# EAGLE design Electronic_Load_AD_V2A (EAGLE 9.1.2)

## Sheet 1 of 6
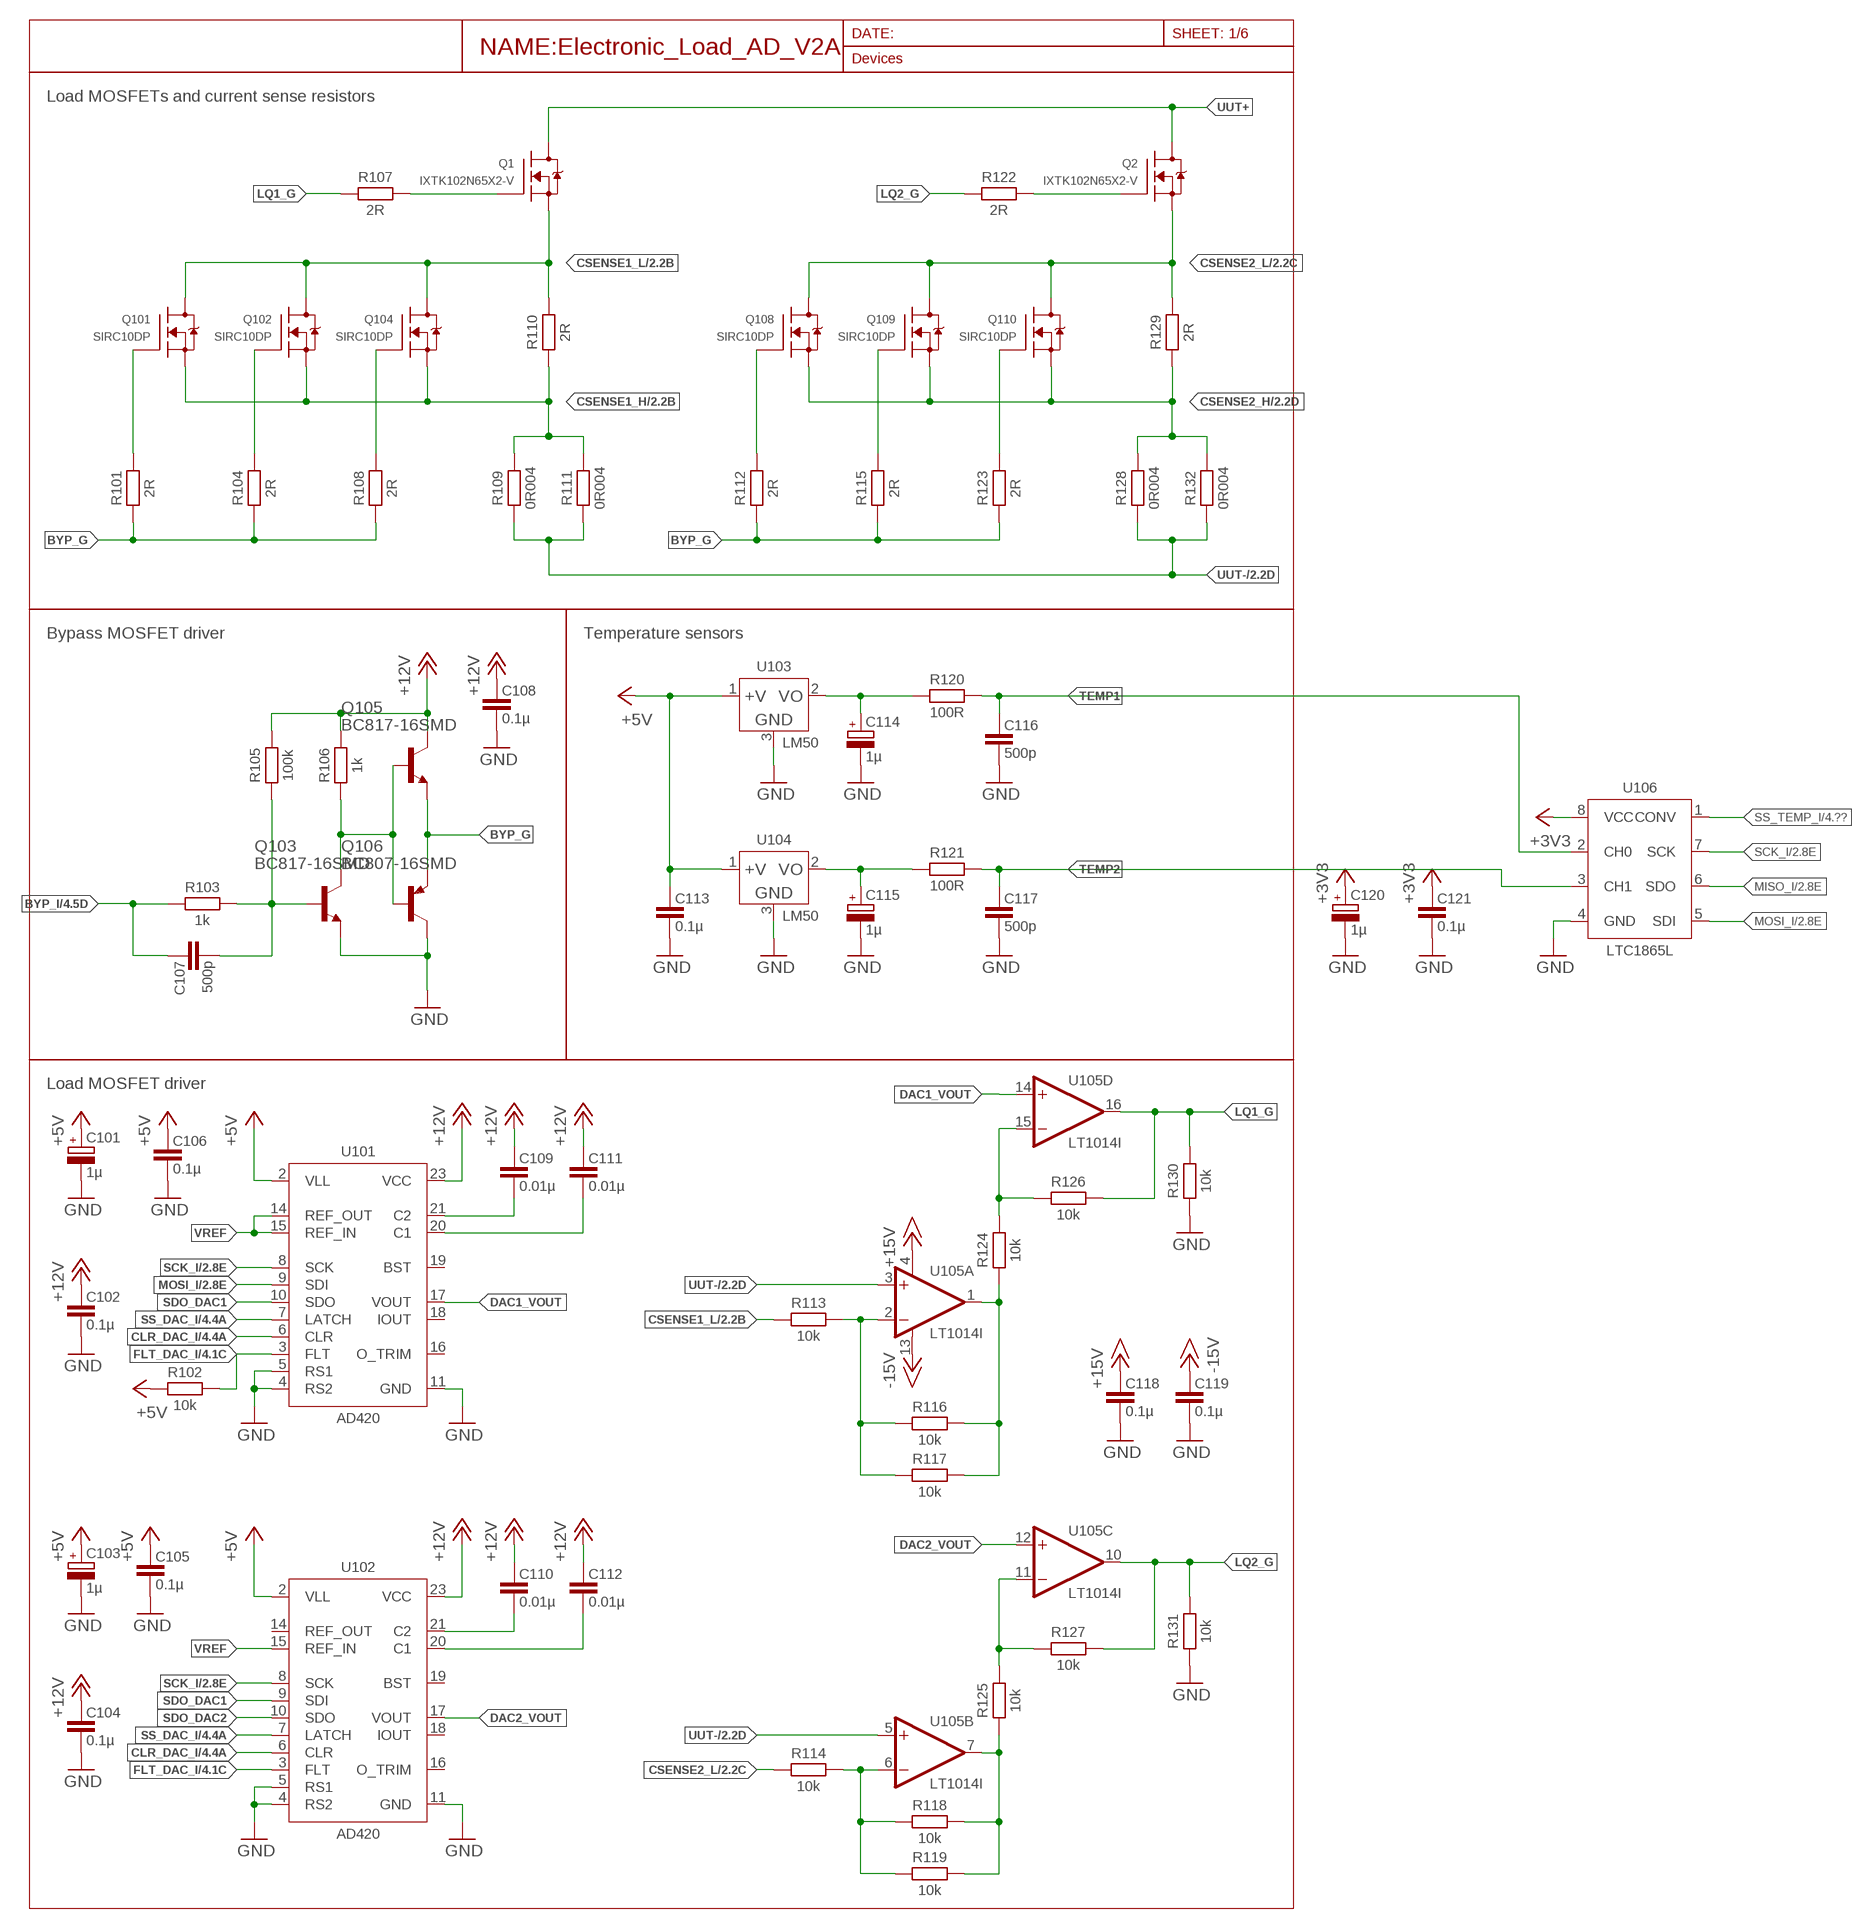
[diagram p0: schematic, sheet 1]

### Parts
C101  1µ  CPOL-3216-A  [CT3216]
C102  0.1µ  C-EU-3216  [C3216]
C103  1µ  CPOL-3216-A  [CT3216]
C104  0.1µ  C-EU-3216  [C3216]
C105  0.1µ  C-EU-3216  [C3216]
C106  0.1µ  C-EU-3216  [C3216]
C107  500p  C-EU-1608  [C1608]
C108  0.1µ  C-EU-3216  [C3216]
C109  0.01µ  C-EU-3216  [C3216]
C110  0.01µ  C-EU-3216  [C3216]
C111  0.01µ  C-EU-3216  [C3216]
C112  0.01µ  C-EU-3216  [C3216]
C113  0.1µ  C-EU-3216  [C3216]
C114  1µ  CPOL-3216-A  [CT3216]
C115  1µ  CPOL-3216-A  [CT3216]
C116  500p  C-EU-1608  [C1608]
C117  500p  C-EU-1608  [C1608]
C118  0.1µ  C-EU-3216  [C3216]
C119  0.1µ  C-EU-3216  [C3216]
C120  1µ  CPOL-3216-A  [CT3216]
C121  0.1µ  C-EU-3216  [C3216]
Q1  IXTK102N65X2-V  [TO-264P-V]
Q2  IXTK102N65X2-V  [TO-264P-V]
Q101  SIRC10DP  [POWERPAK-SO-8]
Q102  SIRC10DP  [POWERPAK-SO-8]
Q103  BC817-16SMD  [SOT23-BEC]
Q104  SIRC10DP  [POWERPAK-SO-8]
Q105  BC817-16SMD  [SOT23-BEC]
Q106  BC807-16SMD  [SOT23-BEC]
Q108  SIRC10DP  [POWERPAK-SO-8]
Q109  SIRC10DP  [POWERPAK-SO-8]
Q110  SIRC10DP  [POWERPAK-SO-8]
R101  2R  R-EU-2012  [R2012W]
R102  10k  R-EU-1608  [R1608]
R103  1k  R-EU-1608  [R1608]
R104  2R  R-EU-2012  [R2012W]
R105  100k  R-EU-1608  [R1608]
R106  1k  R-EU-1608  [R1608]
R107  2R  R-EU-2012  [R2012W]
R108  2R  R-EU-2012  [R2012W]
R109  0R004  R-EU-6332  [R6332W]
R110  2R  R-EU-3216  [R3216W]
R111  0R004  R-EU-6332  [R6332W]
R112  2R  R-EU-2012  [R2012W]
R113  10k  R-EU-1608  [R1608]
R114  10k  R-EU-1608  [R1608]
R115  2R  R-EU-2012  [R2012W]
R116  10k  R-EU-1608  [R1608]
R117  10k  R-EU-1608  [R1608]
R118  10k  R-EU-1608  [R1608]
R119  10k  R-EU-1608  [R1608]
R120  100R  R-EU-2012  [R2012W]
R121  100R  R-EU-2012  [R2012W]
R122  2R  R-EU-2012  [R2012W]
R123  2R  R-EU-2012  [R2012W]
R124  10k  R-EU-1608  [R1608]
R125  10k  R-EU-1608  [R1608]
R126  10k  R-EU-1608  [R1608]
R127  10k  R-EU-1608  [R1608]
R128  0R004  R-EU-6332  [R6332W]
R129  2R  R-EU-3216  [R3216W]
R130  10k  R-EU-1608  [R1608]
R131  10k  R-EU-1608  [R1608]
R132  0R004  R-EU-6332  [R6332W]
U101  AD420  AD420RW-24  [SO24W]
U102  AD420  AD420RW-24  [SO24W]
U103  LM50  [SOT23W]
U104  LM50  [SOT23W]
U105  LT1014I  LT1014ISW  [SO16W]
U106  LTC1865L  [SO8]

### Nets
+3V3: C120.+ C121.1 U106.8(VCC) ; also sheet 2,3
+5V: C101.+ C103.+ C105.1 C106.1 C113.1 R102.1 U101.2(VLL) U102.2(VLL) U103.1(+V) U104.1(+V) ; also sheet 3,4
+12V: C102.1 C104.1 C108.1 C109.1 C110.1 C111.1 C112.1 Q105.C R105.2 R106.2 U101.23(VCC) U102.23(VCC) ; also sheet 3
+15V: C118.1 U105.4(A:V+) ; also sheet 2,3
-15V: C119.1 U105.13(A:V-) ; also sheet 2,3
BYP_G: Q105.E Q106.E R101.1 R104.1 R108.1 R112.1 R115.1 R123.1
BYP_I: C107.1 R103.1 ; also sheet 4
CLR_DAC_I: U101.6(CLR) U102.6(CLR) ; also sheet 4
CSENSE1_H: Q101.1(S) Q101.2(S) Q101.3(S) Q102.1(S) Q102.2(S) Q102.3(S) Q104.1(S) Q104.2(S) Q104.3(S) R109.2 R110.1 R111.2 ; also sheet 2
CSENSE1_L: Q1.3(S) Q101.5(D) Q102.5(D) Q104.5(D) R110.2 R113.1 ; also sheet 2,6
CSENSE2_H: Q108.1(S) Q108.2(S) Q108.3(S) Q109.1(S) Q109.2(S) Q109.3(S) Q110.1(S) Q110.2(S) Q110.3(S) R128.2 R129.1 R132.2 ; also sheet 2
CSENSE2_L: Q2.3(S) Q108.5(D) Q109.5(D) Q110.5(D) R114.1 R129.2 ; also sheet 2,6
DAC1_VOUT: U101.17(VOUT) U105.14(D:+IN)
DAC2_VOUT: U102.17(VOUT) U105.12(C:+IN)
FLT_DAC_I: R102.2 U101.3(FLT) U102.3(FLT) ; also sheet 4
GATE1: Q1.1(G) R107.2 ; also sheet 6
GATE2: Q2.1(G) R122.2 ; also sheet 6
GND: C101.- C102.2 C103.- C104.2 C105.2 C106.2 C108.2 C113.2 C114.- C115.- C116.2 C117.2 C118.2 C119.2 C120.- C121.2 Q103.E Q106.C R130.1 R131.1 U101.4(RS2) U101.5(RS1) U101.11(GND) U102.4(RS2) U102.5(RS1) U102.11(GND) U103.3(GND) U104.3(GND) U106.4(GND) ; also sheet 2,3,4
LBQ11_G: Q101.4(G) R101.2
LBQ12_G: Q102.4(G) R104.2
LBQ13_G: Q104.4(G) R108.2
LBQ21_G: Q108.4(G) R112.2
LBQ22_G: Q109.4(G) R115.2
LBQ23_G: Q110.4(G) R123.2
LQ1_G: R107.1 R126.2 R130.2 U105.16(D:OUT)
LQ2_G: R122.1 R127.2 R131.2 U105.10(C:OUT)
MISO_I: U106.6(SDO) ; also sheet 2,4
MOSI_I: U101.9(SDI) U106.5(SDI) ; also sheet 2,4
N$3: C109.2 U101.21(C2)
N$4: C111.2 U101.20(C1)
N$5: Q103.C Q105.B Q106.B R106.1
N$6: C110.2 U102.21(C2)
N$7: C112.2 U102.20(C1)
N$8: C107.2 Q103.B R103.2 R105.1
N$9: R125.2 R127.1 U105.11(C:-IN)
N$12: R124.2 R126.1 U105.15(D:-IN)
N$13: R116.2 R117.2 R124.1 U105.1(A:OUT)
N$14: R113.2 R116.1 R117.1 U105.2(A:-IN)
N$15: R114.2 R118.1 R119.1 U105.6(B:-IN)
N$16: R118.2 R119.2 R125.1 U105.7(B:OUT)
SCK_I: U101.8(SCK) U102.8(SCK) U106.7(SCK) ; also sheet 2,4
SDO_DAC1: U101.10(SDO) U102.9(SDI)
SDO_DAC2: U102.10(SDO)
SS_DAC_I: U101.7(LATCH) U102.7(LATCH) ; also sheet 4
SS_TEMP_I: U106.1(CONV) ; also sheet 4
T1_OUT: C114.+ R120.1 U103.2(VO) ; also sheet 6
T2_OUT: C115.+ R121.1 U104.2(VO) ; also sheet 6
TEMP1: C116.1 R120.2 U106.2(CH0)
TEMP2: C117.1 R121.2 U106.3(CH1)
UUT+ [500V]: Q1.2(D) Q2.2(D)
UUT-: R109.1 R111.1 R128.1 R132.1 U105.3(A:+IN) U105.5(B:+IN) ; also sheet 2,6
VREF: U101.14(REF_OUT) U101.15(REF_IN) U102.15(REF_IN)
Unconnected: U101.16(O_TRIM) U101.18(IOUT) U101.19(BST) U102.14(REF_OUT) U102.16(O_TRIM) U102.18(IOUT) U102.19(BST)

### Notes on the sheet
- Load MOSFETs and current sense resistors
- Bypass MOSFET driver | Temperature sensors
- Load MOSFET driver

## Sheet 2 of 6
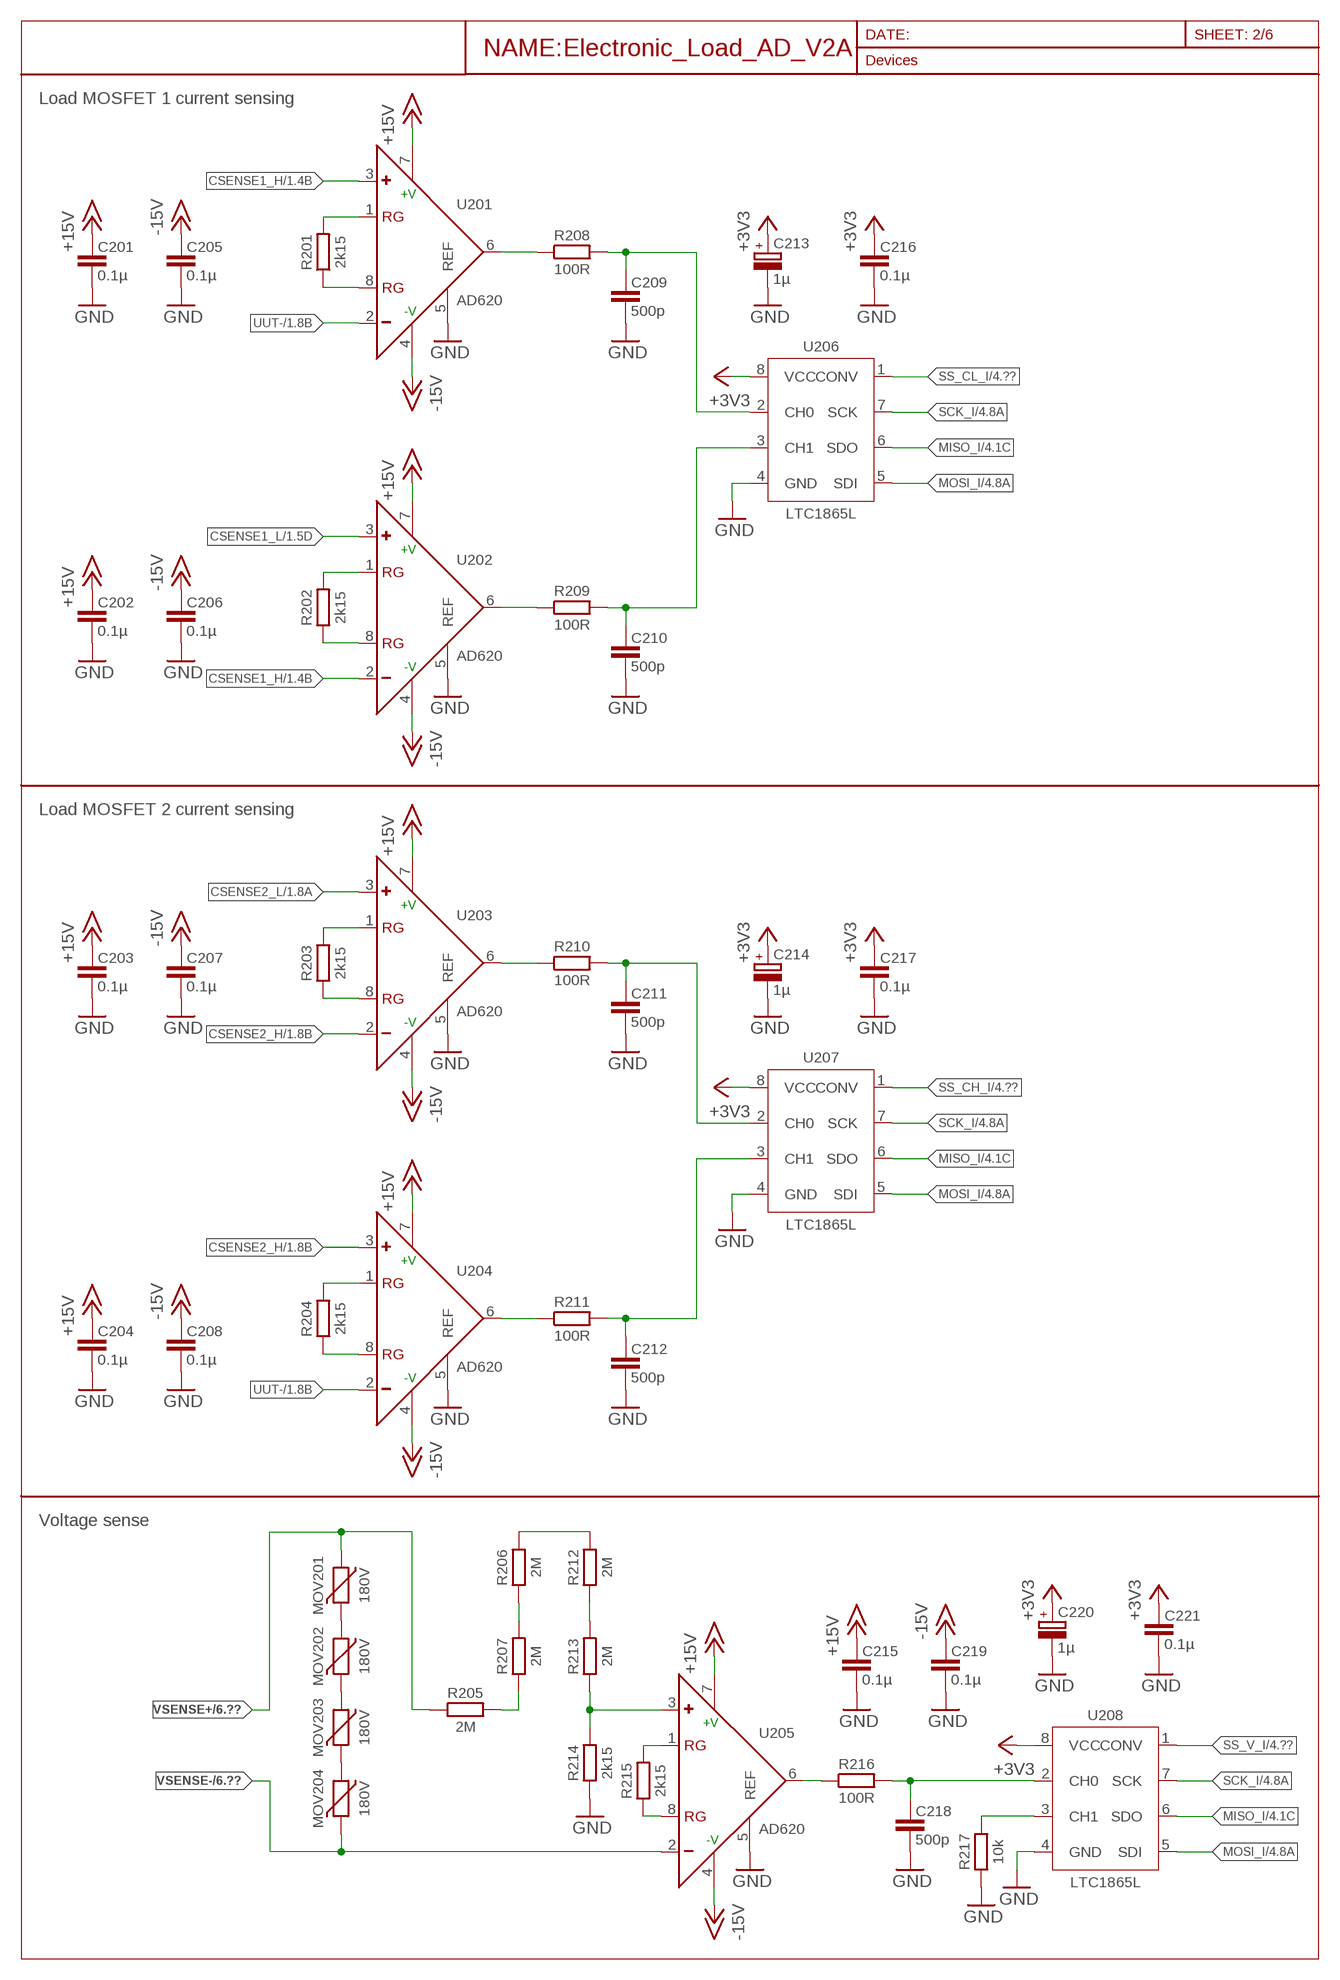
[diagram p1: schematic, sheet 2]

### Parts
C201  0.1µ  C-EU-3216  [C3216]
C202  0.1µ  C-EU-3216  [C3216]
C203  0.1µ  C-EU-3216  [C3216]
C204  0.1µ  C-EU-3216  [C3216]
C205  0.1µ  C-EU-3216  [C3216]
C206  0.1µ  C-EU-3216  [C3216]
C207  0.1µ  C-EU-3216  [C3216]
C208  0.1µ  C-EU-3216  [C3216]
C209  500p  C-EU-1608  [C1608]
C210  500p  C-EU-1608  [C1608]
C211  500p  C-EU-1608  [C1608]
C212  500p  C-EU-1608  [C1608]
C213  1µ  CPOL-3216-A  [CT3216]
C214  1µ  CPOL-3216-A  [CT3216]
C215  0.1µ  C-EU-3216  [C3216]
C216  0.1µ  C-EU-3216  [C3216]
C217  0.1µ  C-EU-3216  [C3216]
C218  500p  C-EU-1608  [C1608]
C219  0.1µ  C-EU-3216  [C3216]
C220  1µ  CPOL-3216-A  [CT3216]
C221  0.1µ  C-EU-3216  [C3216]
MOV201  180V  MOV-3225  [R3225W]
MOV202  180V  MOV-3225  [R3225W]
MOV203  180V  MOV-3225  [R3225W]
MOV204  180V  MOV-3225  [R3225W]
R201  2k15  R-EU-2012  [R2012W]
R202  2k15  R-EU-2012  [R2012W]
R203  2k15  R-EU-2012  [R2012W]
R204  2k15  R-EU-2012  [R2012W]
R205  2M  R-EU-3216  [R3216W]
R206  2M  R-EU-3216  [R3216W]
R207  2M  R-EU-3216  [R3216W]
R208  100R  R-EU-2012  [R2012W]
R209  100R  R-EU-2012  [R2012W]
R210  100R  R-EU-2012  [R2012W]
R211  100R  R-EU-2012  [R2012W]
R212  2M  R-EU-3216  [R3216W]
R213  2M  R-EU-3216  [R3216W]
R214  2k15  R-EU-2012  [R2012W]
R215  2k15  R-EU-2012  [R2012W]
R216  100R  R-EU-2012  [R2012W]
R217  10k  R-EU-1608  [R1608]
U201  AD620  AD620R-8  [SO8]
U202  AD620  AD620R-8  [SO8]
U203  AD620  AD620R-8  [SO8]
U204  AD620  AD620R-8  [SO8]
U205  AD620  AD620R-8  [SO8]
U206  LTC1865L  [SO8]
U207  LTC1865L  [SO8]
U208  LTC1865L  [SO8]

### Nets
+3V3: C213.+ C214.+ C216.1 C217.1 C220.+ C221.1 U206.8(VCC) U207.8(VCC) U208.8(VCC) ; also sheet 1,3
+15V: C201.1 C202.1 C203.1 C204.1 C215.1 U201.7(+V) U202.7(+V) U203.7(+V) U204.7(+V) U205.7(+V) ; also sheet 1,3
-15V: C205.1 C206.1 C207.1 C208.1 C219.1 U201.4(-V) U202.4(-V) U203.4(-V) U204.4(-V) U205.4(-V) ; also sheet 1,3
CSENSE1_H: U201.3(+) U202.2(-) ; also sheet 1
CSENSE1_L: U202.3(+) ; also sheet 1,6
CSENSE2_H: U203.2(-) U204.3(+) ; also sheet 1
CSENSE2_L: U203.3(+) ; also sheet 1,6
GND: C201.2 C202.2 C203.2 C204.2 C205.2 C206.2 C207.2 C208.2 C209.2 C210.2 C211.2 C212.2 C213.- C214.- C215.2 C216.2 C217.2 C218.2 C219.2 C220.- C221.2 R214.1 R217.1 U201.5(REF) U202.5(REF) U203.5(REF) U204.5(REF) U205.5(REF) U206.4(GND) U207.4(GND) U208.4(GND) ; also sheet 1,3,4
MISO_I: U206.6(SDO) U207.6(SDO) U208.6(SDO) ; also sheet 1,4
MOSI_I: U206.5(SDI) U207.5(SDI) U208.5(SDI) ; also sheet 1,4
N$1: MOV201.2 MOV202.1
N$2: MOV202.2 MOV203.1
N$17: R210.1 U203.6(OUT)
N$18: C211.1 R210.2 U207.2(CH0)
N$19: R211.1 U204.6(OUT)
N$20: C212.1 R211.2 U207.3(CH1)
N$21: C209.1 R208.2 U206.2(CH0)
N$22: C210.1 R209.2 U206.3(CH1)
N$23: R209.1 U202.6(OUT)
N$24: R208.1 U201.6(OUT)
N$25: R212.1 R213.2
N$26: R206.2 R212.2
N$27: R206.1 R207.2
N$28: R205.2 R207.1
N$29: R213.1 R214.2 U205.3(+)
N$30: C218.1 R216.2 U208.2(CH0)
N$31: R216.1 U205.6(OUT)
N$36: MOV203.2 MOV204.1
N$45: R217.2 U208.3(CH1)
RG1_H4: R203.2 U203.1(RG)
RG1_H5: R204.2 U204.1(RG)
RG1_H6: R215.2 U205.1(RG)
RG1_L3: R201.2 U201.1(RG)
RG1_L4: R202.2 U202.1(RG)
RG2_H4: R203.1 U203.8(RG)
RG2_H5: R204.1 U204.8(RG)
RG2_H6: R215.1 U205.8(RG)
RG2_L3: R201.1 U201.8(RG)
RG2_L4: R202.1 U202.8(RG)
SCK_I: U206.7(SCK) U207.7(SCK) U208.7(SCK) ; also sheet 1,4
SS_CH_I: U207.1(CONV) ; also sheet 4
SS_CL_I: U206.1(CONV) ; also sheet 4
SS_V_I: U208.1(CONV) ; also sheet 4
UUT-: U201.2(-) U204.2(-) ; also sheet 1,6
VSENSE+: MOV201.1 R205.1 ; also sheet 6
VSENSE-: MOV204.2 U205.2(-) ; also sheet 6

### Notes on the sheet
- Load MOSFET 1 current sensing
- Load MOSFET 2 current sensing
- Voltage sense

## Sheet 3 of 6
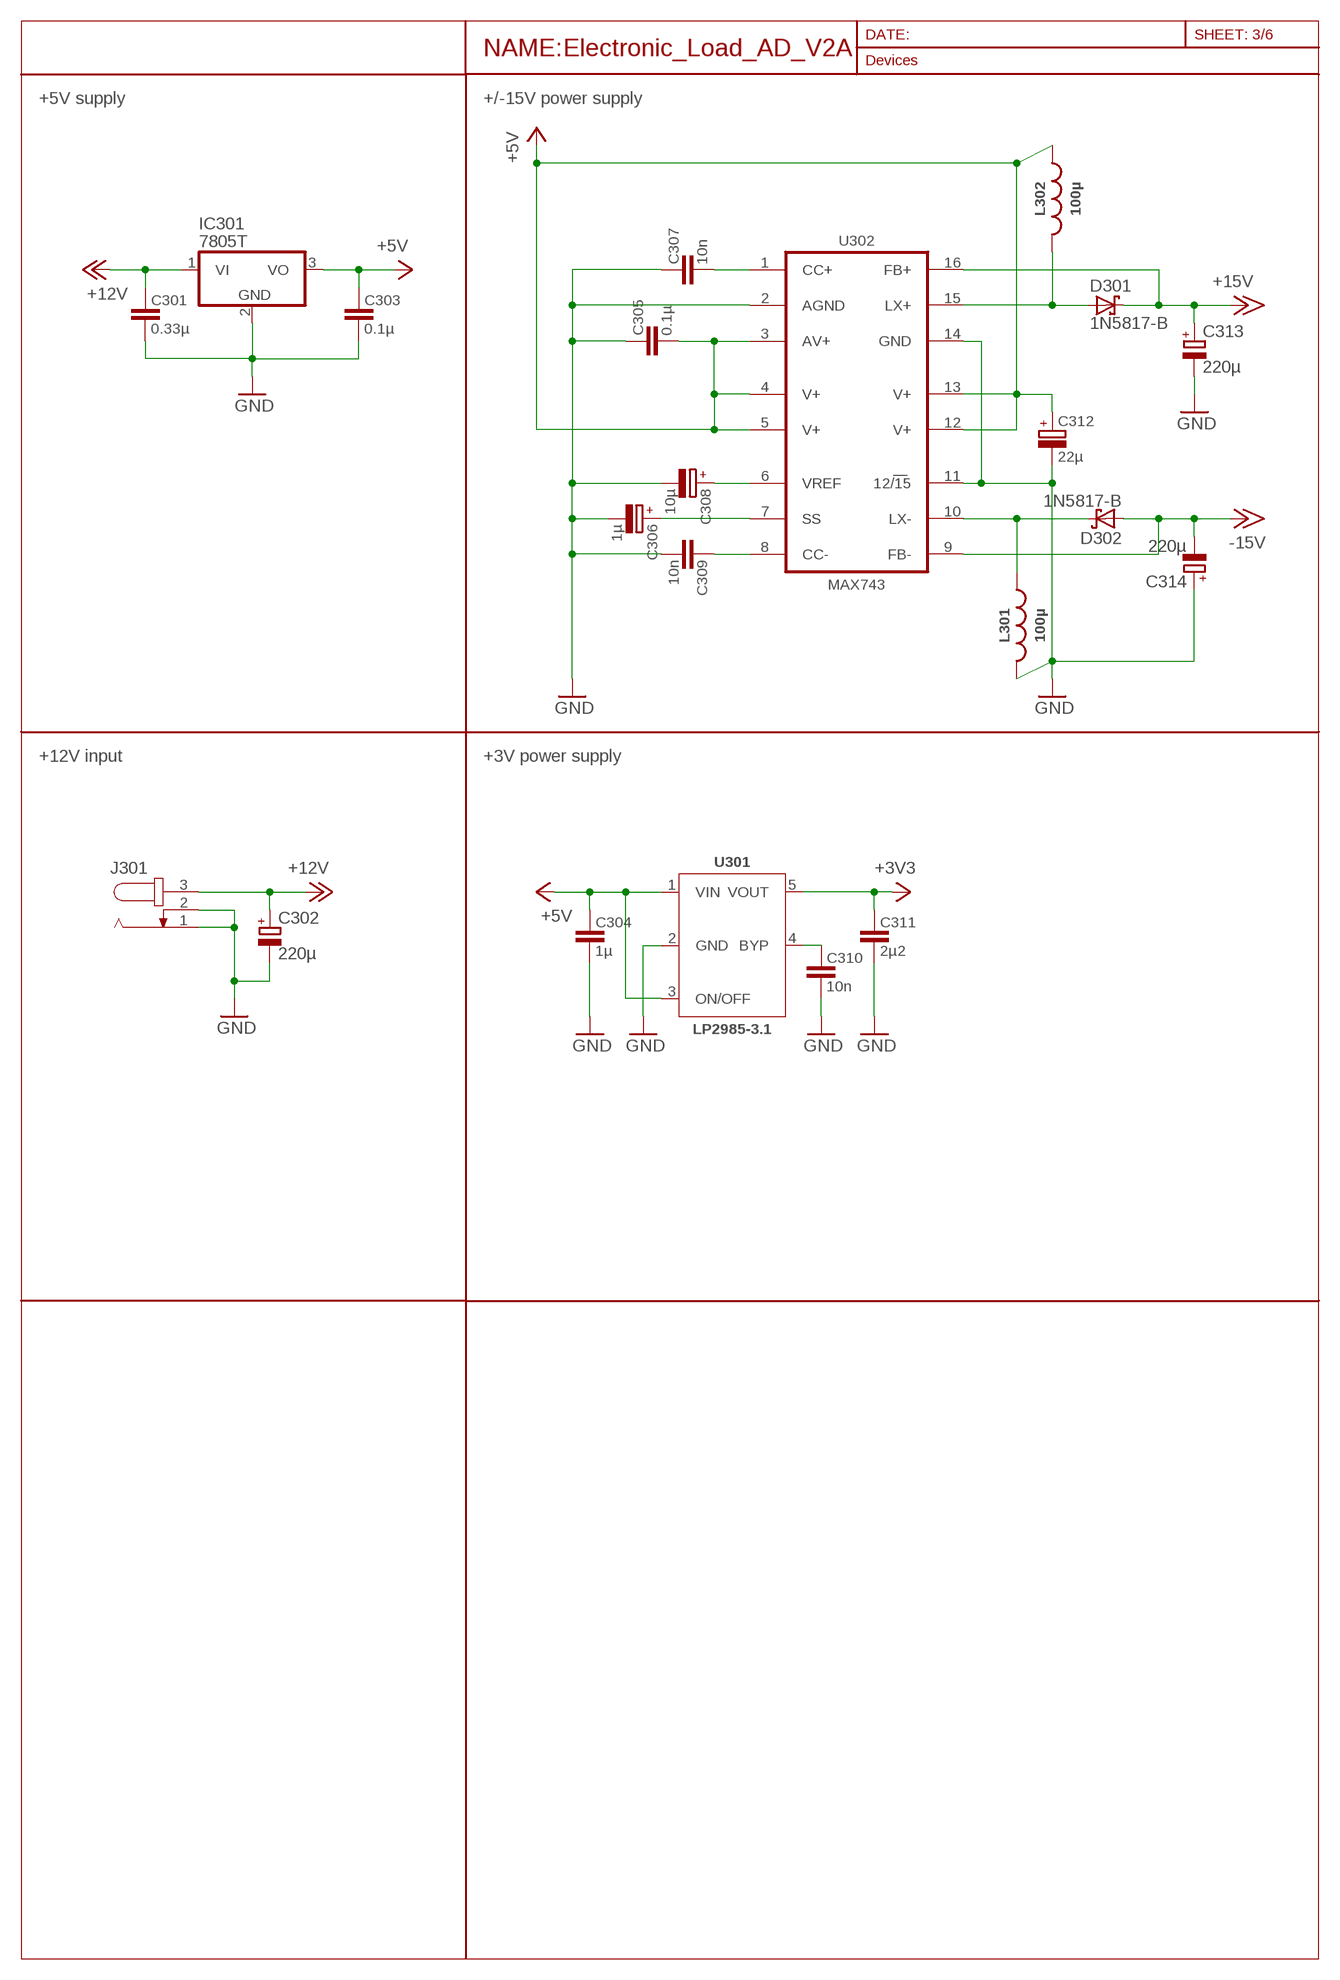
[diagram p2: schematic, sheet 3]

### Parts
C301  0.33µ  C-EU-3216  [C3216]
C302  220µ  CPOL-EUE3.5-10  [E3,5-10]
C303  0.1µ  C-EU-3216  [C3216]
C304  1µ  C-EU-3216  [C3216]
C305  0.1µ  C-EU-3216  [C3216]
C306  1µ  CPOL-3216-A  [CT3216]
C307  10n  C-EU-3216  [C3216]
C308  10µ  CPOL-6032-C  [CT6032]
C309  10n  C-EU-3216  [C3216]
C310  10n  C-EU-3216  [C3216]
C311  2µ2  C-EU-3216  [C3216]
C312  22µ  CPOL-6032-C  [CT6032]
C313  220µ  CPOL-EUE3.5-10  [E3,5-10]
C314  220µ  CPOL-EUE3.5-10  [E3,5-10]
D301  1N5817-B  [DO41-7.6]
D302  1N5817-B  [DO41-7.6]
IC301  7805T  [TO220H]
J301  JACK-PLUG0  [SPC4077]
L301  100µ  L-EUSRN1060  [SRN1060]
L302  100µ  L-EUSRN1060  [SRN1060]
U301  LP2985-3.1  [SOT23-5L]
U302  MAX743  MAX743WE  [SO16W]

### Nets
+3V3: C311.1 U301.5(VOUT) ; also sheet 1,2
+5V: C303.1 C304.1 C305.2 C312.+ IC301.3(VO) L302.1 U301.1(VIN) U301.3(ON/OFF) U302.3(AV+) U302.4(V+) U302.5(V+) U302.12(V+) U302.13(V+) ; also sheet 1,4
+12V: C301.1 C302.+ IC301.1(VI) J301.3 ; also sheet 1
+15V: C313.+ D301.C U302.16(FB+) ; also sheet 1,2
-15V: C314.- D302.A U302.9(FB-) ; also sheet 1,2
GND: C301.2 C302.- C303.2 C304.2 C305.1 C306.- C307.1 C308.- C309.2 C310.2 C311.2 C312.- C313.- C314.+ IC301.2(GND) J301.1 J301.2 L301.2 U301.2(GND) U302.2(AGND) U302.11(12/15) U302.14(GND) ; also sheet 1,2,4
N$10: C310.1 U301.4(BYP)
N$32: C309.1 U302.8(CC-)
N$33: C306.+ U302.7(SS)
N$34: C307.2 U302.1(CC+)
N$35: D301.A L302.2 U302.15(LX+)
N$41: D302.C L301.1 U302.10(LX-)
VREF2: C308.+ U302.6(VREF)

### Notes on the sheet
- +5V supply | +/-15V power supply
- +12V input | +3V power supply

## Sheet 4 of 6
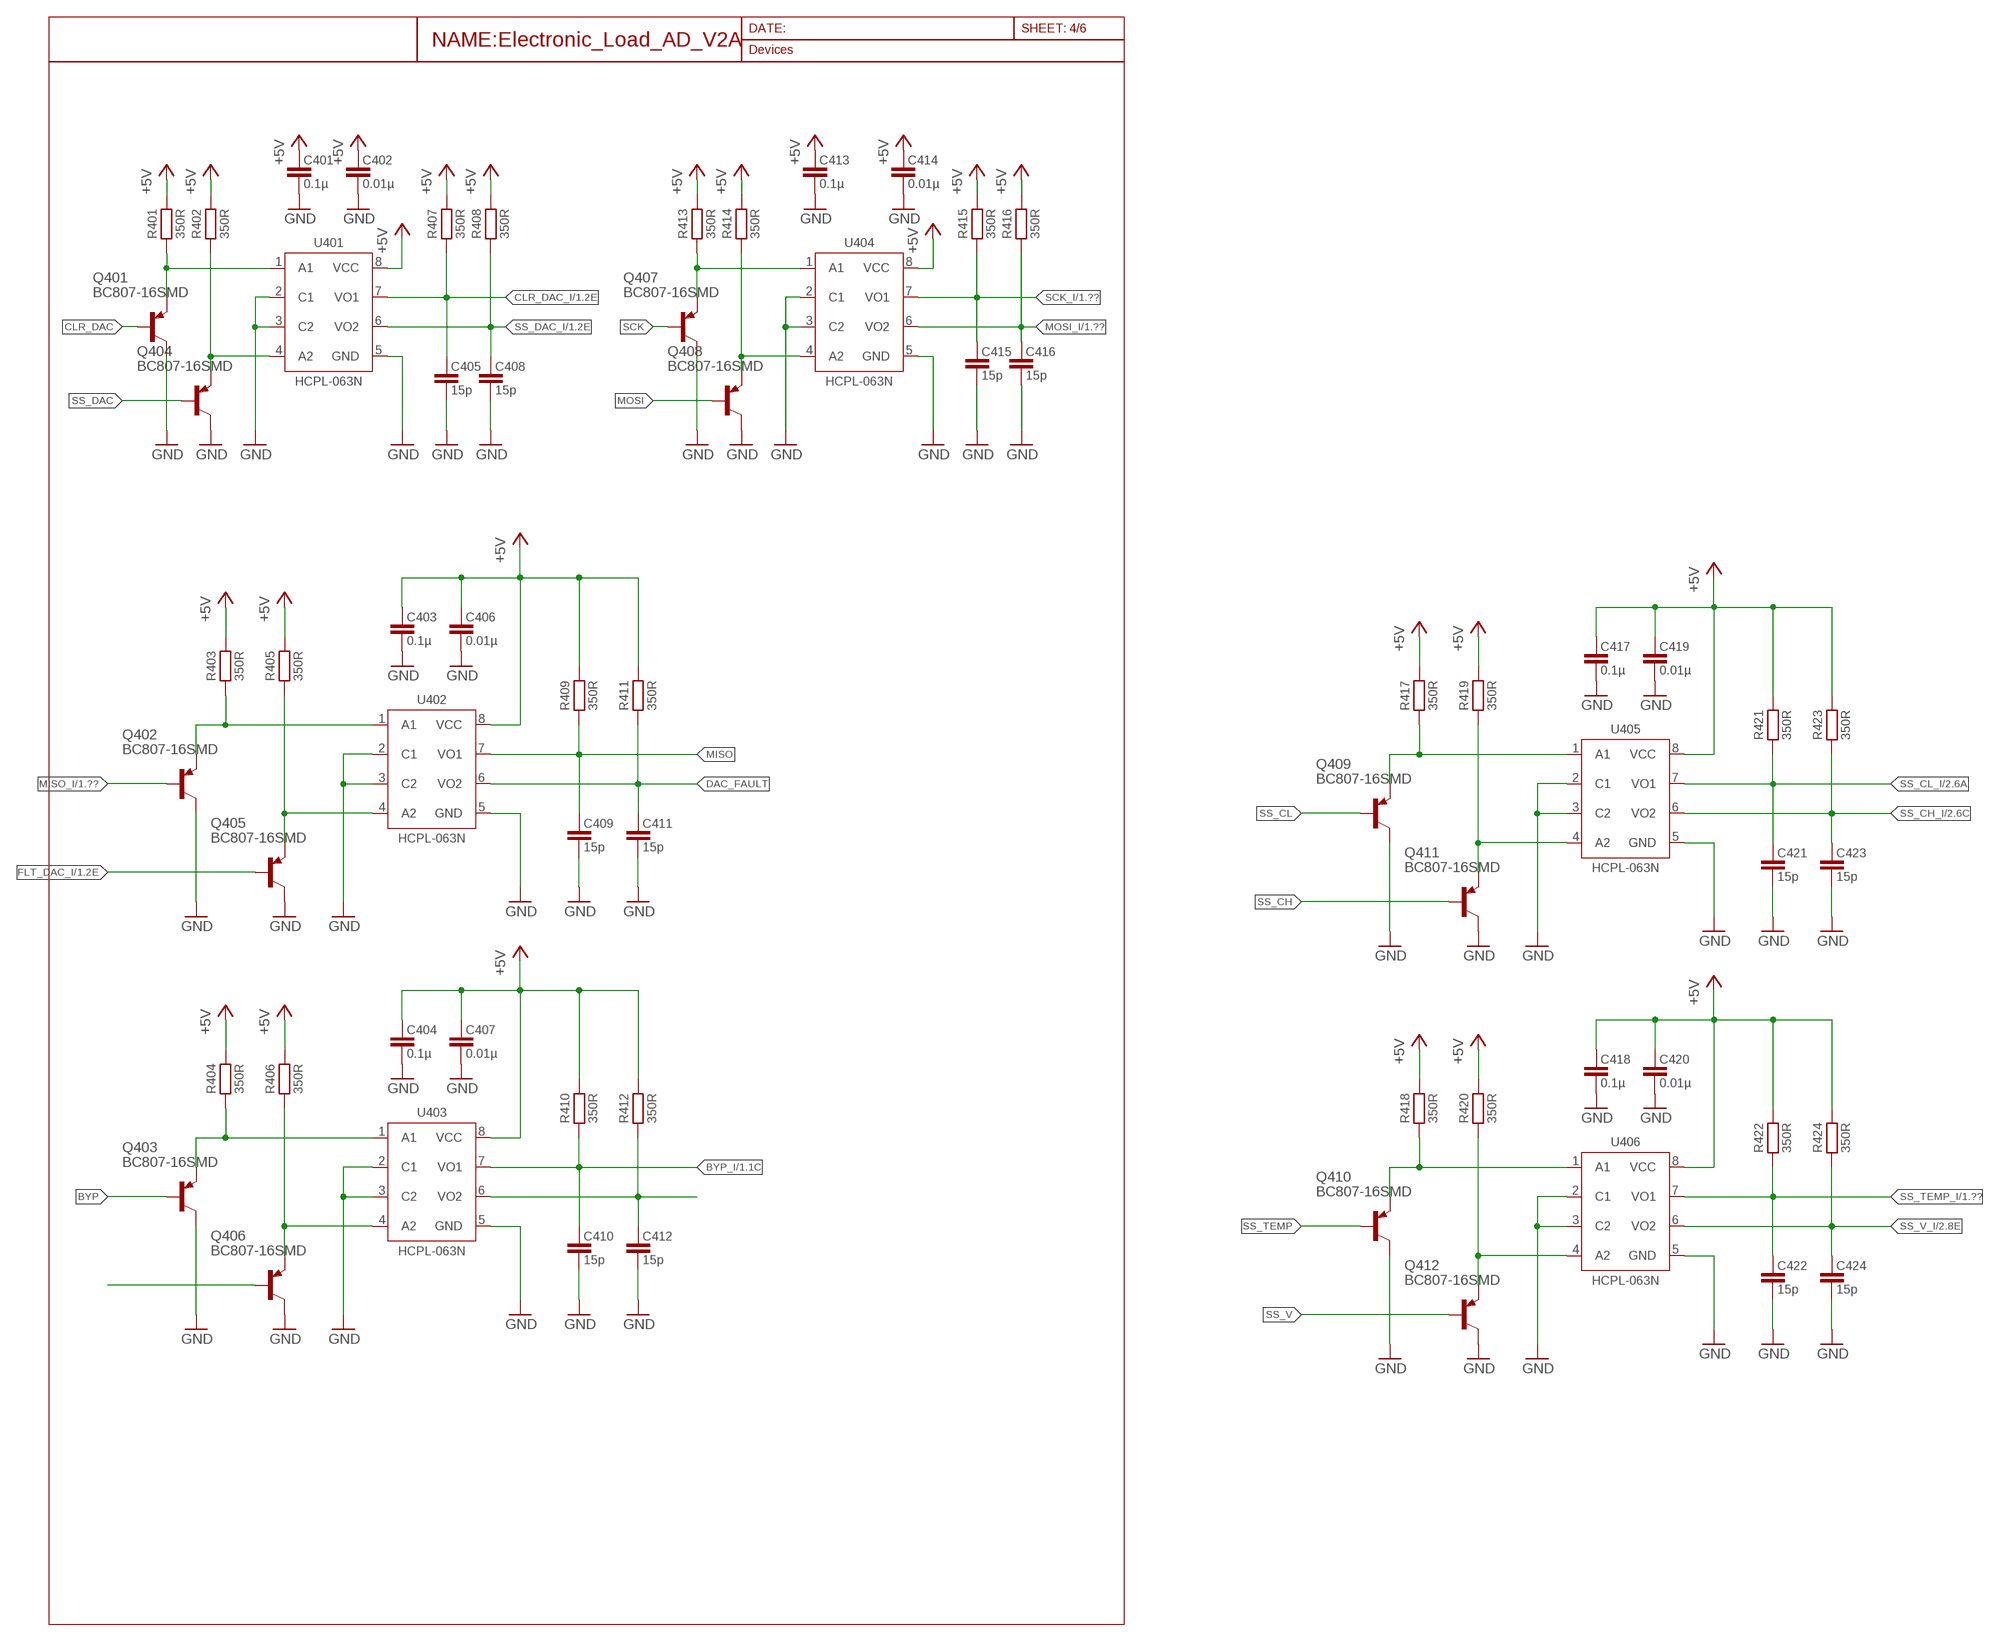
[diagram p3: schematic, sheet 4]

### Parts
C401  0.1µ  C-EU-3216  [C3216]
C402  0.01µ  C-EU-3216  [C3216]
C403  0.1µ  C-EU-3216  [C3216]
C404  0.1µ  C-EU-3216  [C3216]
C405  15p  C-EU-1608  [C1608]
C406  0.01µ  C-EU-3216  [C3216]
C407  0.01µ  C-EU-3216  [C3216]
C408  15p  C-EU-1608  [C1608]
C409  15p  C-EU-1608  [C1608]
C410  15p  C-EU-1608  [C1608]
C411  15p  C-EU-1608  [C1608]
C412  15p  C-EU-1608  [C1608]
C413  0.1µ  C-EU-3216  [C3216]
C414  0.01µ  C-EU-3216  [C3216]
C415  15p  C-EU-1608  [C1608]
C416  15p  C-EU-1608  [C1608]
C417  0.1µ  C-EU-3216  [C3216]
C418  0.1µ  C-EU-3216  [C3216]
C419  0.01µ  C-EU-3216  [C3216]
C420  0.01µ  C-EU-3216  [C3216]
C421  15p  C-EU-1608  [C1608]
C422  15p  C-EU-1608  [C1608]
C423  15p  C-EU-1608  [C1608]
C424  15p  C-EU-1608  [C1608]
Q401  BC807-16SMD  [SOT23-BEC]
Q402  BC807-16SMD  [SOT23-BEC]
Q403  BC807-16SMD  [SOT23-BEC]
Q404  BC807-16SMD  [SOT23-BEC]
Q405  BC807-16SMD  [SOT23-BEC]
Q406  BC807-16SMD  [SOT23-BEC]
Q407  BC807-16SMD  [SOT23-BEC]
Q408  BC807-16SMD  [SOT23-BEC]
Q409  BC807-16SMD  [SOT23-BEC]
Q410  BC807-16SMD  [SOT23-BEC]
Q411  BC807-16SMD  [SOT23-BEC]
Q412  BC807-16SMD  [SOT23-BEC]
R401  350R  R-EU-1608  [R1608]
R402  350R  R-EU-1608  [R1608]
R403  350R  R-EU-1608  [R1608]
R404  350R  R-EU-1608  [R1608]
R405  350R  R-EU-1608  [R1608]
R406  350R  R-EU-1608  [R1608]
R407  350R  R-EU-1608  [R1608]
R408  350R  R-EU-1608  [R1608]
R409  350R  R-EU-1608  [R1608]
R410  350R  R-EU-1608  [R1608]
R411  350R  R-EU-1608  [R1608]
R412  350R  R-EU-1608  [R1608]
R413  350R  R-EU-1608  [R1608]
R414  350R  R-EU-1608  [R1608]
R415  350R  R-EU-1608  [R1608]
R416  350R  R-EU-1608  [R1608]
R417  350R  R-EU-1608  [R1608]
R418  350R  R-EU-1608  [R1608]
R419  350R  R-EU-1608  [R1608]
R420  350R  R-EU-1608  [R1608]
R421  350R  R-EU-1608  [R1608]
R422  350R  R-EU-1608  [R1608]
R423  350R  R-EU-1608  [R1608]
R424  350R  R-EU-1608  [R1608]
U401  HCPL-063N  [SO8]
U402  HCPL-063N  [SO8]
U403  HCPL-063N  [SO8]
U404  HCPL-063N  [SO8]
U405  HCPL-063N  [SO8]
U406  HCPL-063N  [SO8]

### Nets
+5V: C401.1 C402.1 C403.1 C404.1 C406.1 C407.1 C413.1 C414.1 C417.1 C418.1 C419.1 C420.1 R401.2 R402.2 R403.2 R404.2 R405.2 R406.2 R407.2 R408.2 R409.2 R410.2 R411.2 R412.2 R413.2 R414.2 R415.2 R416.2 R417.2 R418.2 R419.2 R420.2 R421.2 R422.2 R423.2 R424.2 U401.8(VCC) U402.8(VCC) U403.8(VCC) U404.8(VCC) U405.8(VCC) U406.8(VCC) ; also sheet 1,3
BYP: Q403.B
BYP_I: C410.1 R410.1 U403.7(VO1) ; also sheet 1
CLR_DAC: Q401.B
CLR_DAC_I: C405.1 R407.1 U401.7(VO1) ; also sheet 1
DAC_FAULT: C411.1 R411.1 U402.6(VO2)
FLT_DAC_I: Q405.B ; also sheet 1
GND: C401.2 C402.2 C403.2 C404.2 C405.2 C406.2 C407.2 C408.2 C409.2 C410.2 C411.2 C412.2 C413.2 C414.2 C415.2 C416.2 C417.2 C418.2 C419.2 C420.2 C421.2 C422.2 C423.2 C424.2 Q401.C Q402.C Q403.C Q404.C Q405.C Q406.C Q407.C Q408.C Q409.C Q410.C Q411.C Q412.C U401.2(C1) U401.3(C2) U401.5(GND) U402.2(C1) U402.3(C2) U402.5(GND) U403.2(C1) U403.3(C2) U403.5(GND) U404.2(C1) U404.3(C2) U404.5(GND) U405.2(C1) U405.3(C2) U405.5(GND) U406.2(C1) U406.3(C2) U406.5(GND) ; also sheet 1,2,3
MISO: C409.1 R409.1 U402.7(VO1)
MISO_I: Q402.B ; also sheet 1,2
MOSI: Q408.B
MOSI_I: C416.1 R416.1 U404.6(VO2) ; also sheet 1,2
N$47: Q407.E R413.1 U404.1(A1)
N$49: Q409.E R417.1 U405.1(A1)
N$62: Q408.E R414.1 U404.4(A2)
N$63: Q411.E R419.1 U405.4(A2)
N$64: Q410.E R418.1 U406.1(A1)
N$65: Q412.E R420.1 U406.4(A2)
N$66: Q402.E R403.1 U402.1(A1)
N$67: Q405.E R405.1 U402.4(A2)
N$68: Q403.E R404.1 U403.1(A1)
N$69: Q406.E R406.1 U403.4(A2)
N$71: Q406.B
N$73: C412.1 R412.1 U403.6(VO2)
N$76: Q401.E R401.1 U401.1(A1)
N$77: Q404.E R402.1 U401.4(A2)
SCK: Q407.B
SCK_I: C415.1 R415.1 U404.7(VO1) ; also sheet 1,2
SS_CH: Q411.B
SS_CH_I: C423.1 R423.1 U405.6(VO2) ; also sheet 2
SS_CL: Q409.B
SS_CL_I: C421.1 R421.1 U405.7(VO1) ; also sheet 2
SS_DAC: Q404.B
SS_DAC_I: C408.1 R408.1 U401.6(VO2) ; also sheet 1
SS_TEMP: Q410.B
SS_TEMP_I: C422.1 R422.1 U406.7(VO1) ; also sheet 1
SS_V: Q412.B
SS_V_I: C424.1 R424.1 U406.6(VO2) ; also sheet 2

## Sheet 5 of 6

## Sheet 6 of 6
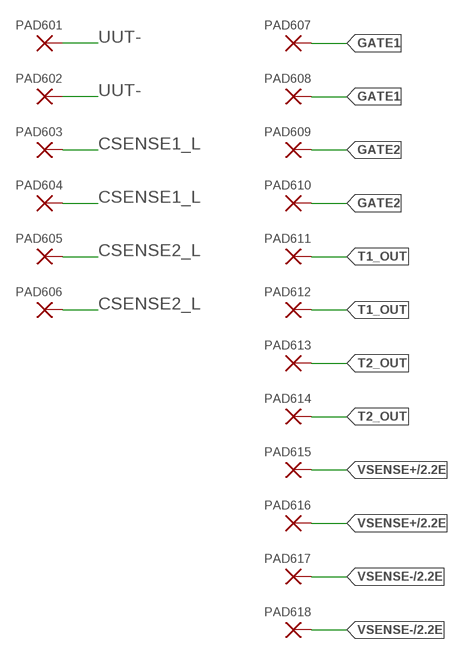
[diagram p4: schematic, sheet 6]

### Parts
PAD601  PAD-10X4  [PAD-10X4]
PAD602  PAD-10X4  [PAD-10X4]
PAD603  PAD-10X4  [PAD-10X4]
PAD604  PAD-10X4  [PAD-10X4]
PAD605  PAD-10X4  [PAD-10X4]
PAD606  PAD-10X4  [PAD-10X4]
PAD607  PAD-5X2  [PAD-5X2]
PAD608  PAD-5X2  [PAD-5X2]
PAD609  PAD-5X2  [PAD-5X2]
PAD610  PAD-5X2  [PAD-5X2]
PAD611  PAD-5X2  [PAD-5X2]
PAD612  PAD-5X2  [PAD-5X2]
PAD613  PAD-5X2  [PAD-5X2]
PAD614  PAD-5X2  [PAD-5X2]
PAD615  PAD-5X2  [PAD-5X2]
PAD616  PAD-5X2  [PAD-5X2]
PAD617  PAD-5X2  [PAD-5X2]
PAD618  PAD-5X2  [PAD-5X2]

### Nets
CSENSE1_L: PAD603.1(P) PAD604.1(P) ; also sheet 1,2
CSENSE2_L: PAD605.1(P) PAD606.1(P) ; also sheet 1,2
GATE1: PAD607.1(P) PAD608.1(P) ; also sheet 1
GATE2: PAD609.1(P) PAD610.1(P) ; also sheet 1
T1_OUT: PAD611.1(P) PAD612.1(P) ; also sheet 1
T2_OUT: PAD613.1(P) PAD614.1(P) ; also sheet 1
UUT-: PAD601.1(P) PAD602.1(P) ; also sheet 1,2
VSENSE+: PAD615.1(P) PAD616.1(P) ; also sheet 2
VSENSE-: PAD617.1(P) PAD618.1(P) ; also sheet 2

## Library data of the parts
C101 C103 C114 C115 C120 C213 C214 C220 C306 C308 C312 = passives:CPOL
C102 C104-C113 C116-C119 C121 C201-C212 C215-C219 C221 C301 C303-C305 C307 C309-C311 C401-C424 = passives:C-EU
C302 C313 C314 = rcl:CPOL-EU: POLARIZED CAPACITOR, European symbol; SPICEPREFIX: C
D301 D302 = diode:1N581*: 1.0A SCHOTTKY BARRIER RECTIFIER Source: http://www.diodes.com/datasheets/ds23001.pdf
IC301 = linear:78*: Positive VOLTAGE REGULATOR Source: http://cache.national.com/ds/LM/LM78L05.pdf http://www.fairchildsemi.com/ds/LM/LM7805.pdf
J301 = con-jack:JACK-PLUG: DC POWER JACK Power Jack, DC, Right Angle, Through Hole, Rated 5A at 16VDC, PC Terminals Distributor: Farnell (www.Farnell.de) Drawing: 84N1161.pdf / 84N1162.pdf Manufacturer: SPC Technology (www.spctechnology.com) Type: SPC4077 / SPC 4078; OC_FARNELL: unknown; OC_NEWARK: unknown
L301 L302 = passives:L-EU
MOV201-MOV204 = passives:MOV
PAD601-PAD618 = pads:PAD
Q1 Q2 = transistors:IXTK102N65X2
Q101 Q102 Q104 Q108-Q110 = transistors:SIRC10DP
Q103 Q105 = transistor-npn:BC817*: NPN Transistor
Q106 Q401-Q412 = transistor-pnp:BC807*: PNP Transistror
R101-R132 R201-R217 R401-R424 = passives:R-EU
U101 U102 = ic:AD420: The AD420 is a complete digital to current loop output converter, designed to meet the needs of the industrial control market. It provides a high precision, fully integrated, low cost single-chip solution for generating current loop signals in a compact 24-lead SOIC or PDIP package. The output current range can be programmed to 4 mA to 20 mA, 0 mA to 20 mA or to an overrange function of 0 mA to 24 mA. The AD420 can alternatively provide a voltage output from a separate pin that can be configured to provide 0 V to 5 V, 0 V to 10 V, ±5 V, or ±10 V with the addition of a single external buffer amplifier.
U103 U104 = ic:LM50
U105 = ic:LT1014: The LT ®1014 is the first precision quad operational amplifier which directly upgrades designs in the industry standard 14-pin DIP LM324/LM348/OP-11/4156 pin configuration. It is no longer necessary to compromise specifications, while saving board space and cost, as compared to single operational amplifiers. The LT1014’s low offset voltage of 50µV, drift of 0.3µV/°C, offset current of 0.15nA, gain of 8 million, common mode rejection of 117dB and power supply rejection of 120dB qualify it as four truly precision operational amplifiers. Particularly important is the low offset voltage, since no offset null terminals are provided in the quad configuration. Although supply current is only 350µA per amplifier, a new output stage design sources and sinks in excess of 20mA of load current, while retaining high voltage gain.
U106 U206-U208 = ic:LTC1865L: The LTC®1864L/LTC1865L are 16-bit A/D converters that are offered in MSOP and SO-8 packages and operate on a single 3V supply. At 150ksps, the supply current is only 450µA. The supply current drops at lower speeds because the LTC1864L/LTC1865L automatically power down between conversions. These 16-bit switched capacitor successive approximation ADCs include sample-and-holds. The LTC1864L has a differential analog input with an external reference pin. The LTC1865L offers a softwareselectable 2-channel MUX and an external reference pin on the MSOP version. The 3-wire, serial I/O, small MSOP or SO-8 package and extremely high sample rate-to-power ratio make these ADCs ideal choices for compact, low power, high speed systems
U201-U205 = ic:AD620
U301 = ic:LP2985
U302 = ic:MAX743
U401-U406 = ic:HCPL-063N

## Net classes
0 default: width 0.203 mm, drill 0.3 mm, clearance 0.203 mm
1 500V: width 0.203 mm, drill 0.3 mm, clearance 3 mm

## Board
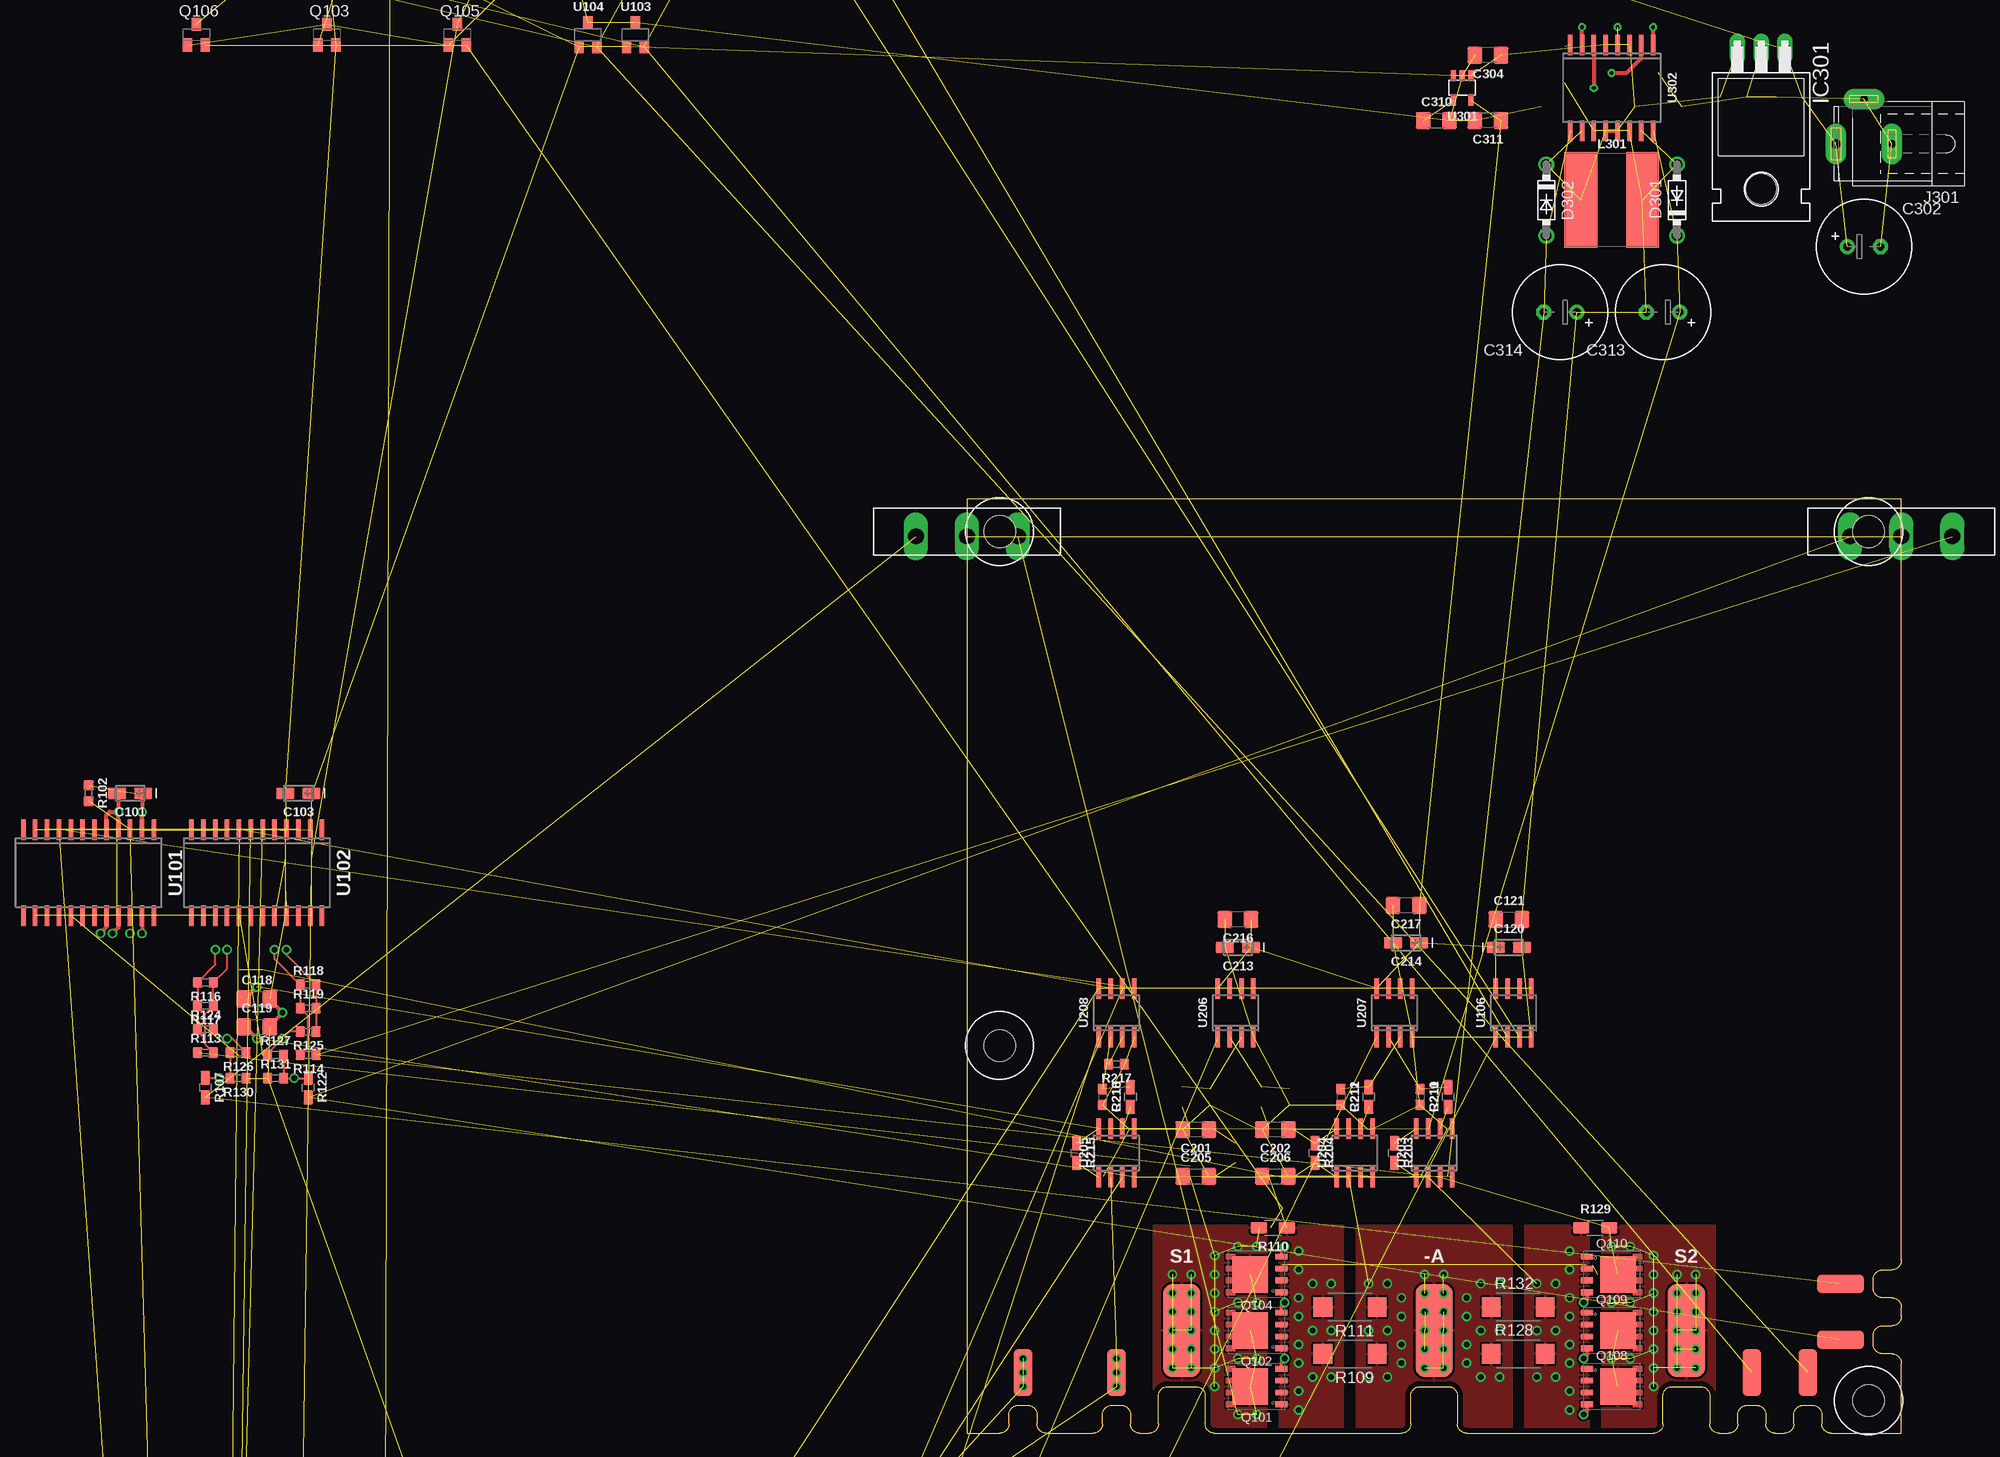
[diagram p5: board, top side]
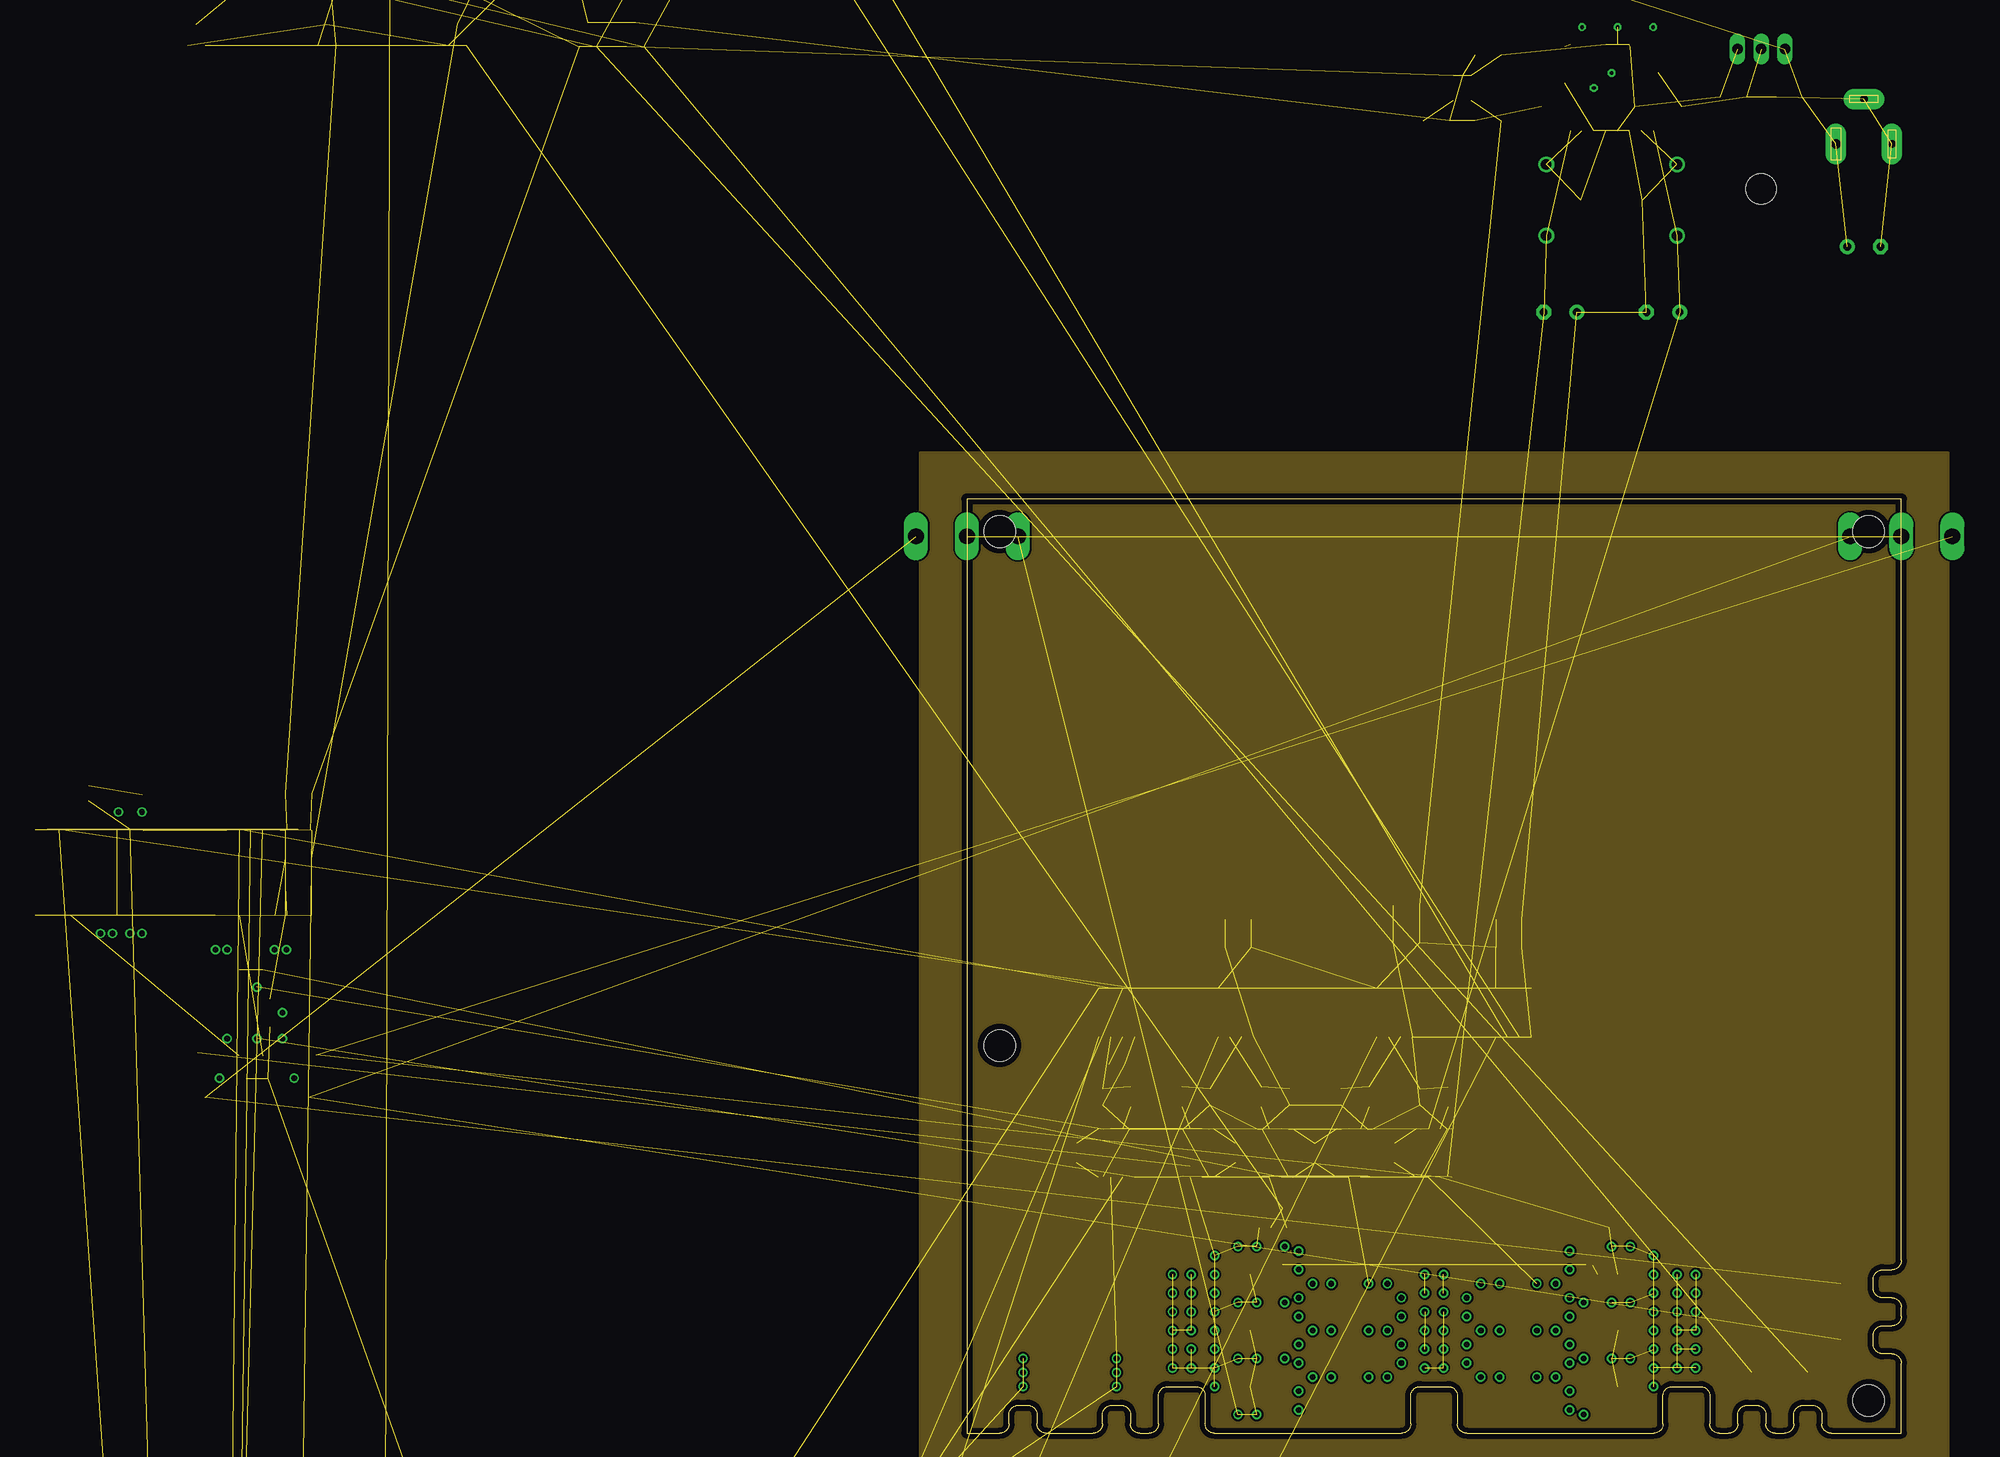
[diagram p6: board, inner layer Route2]
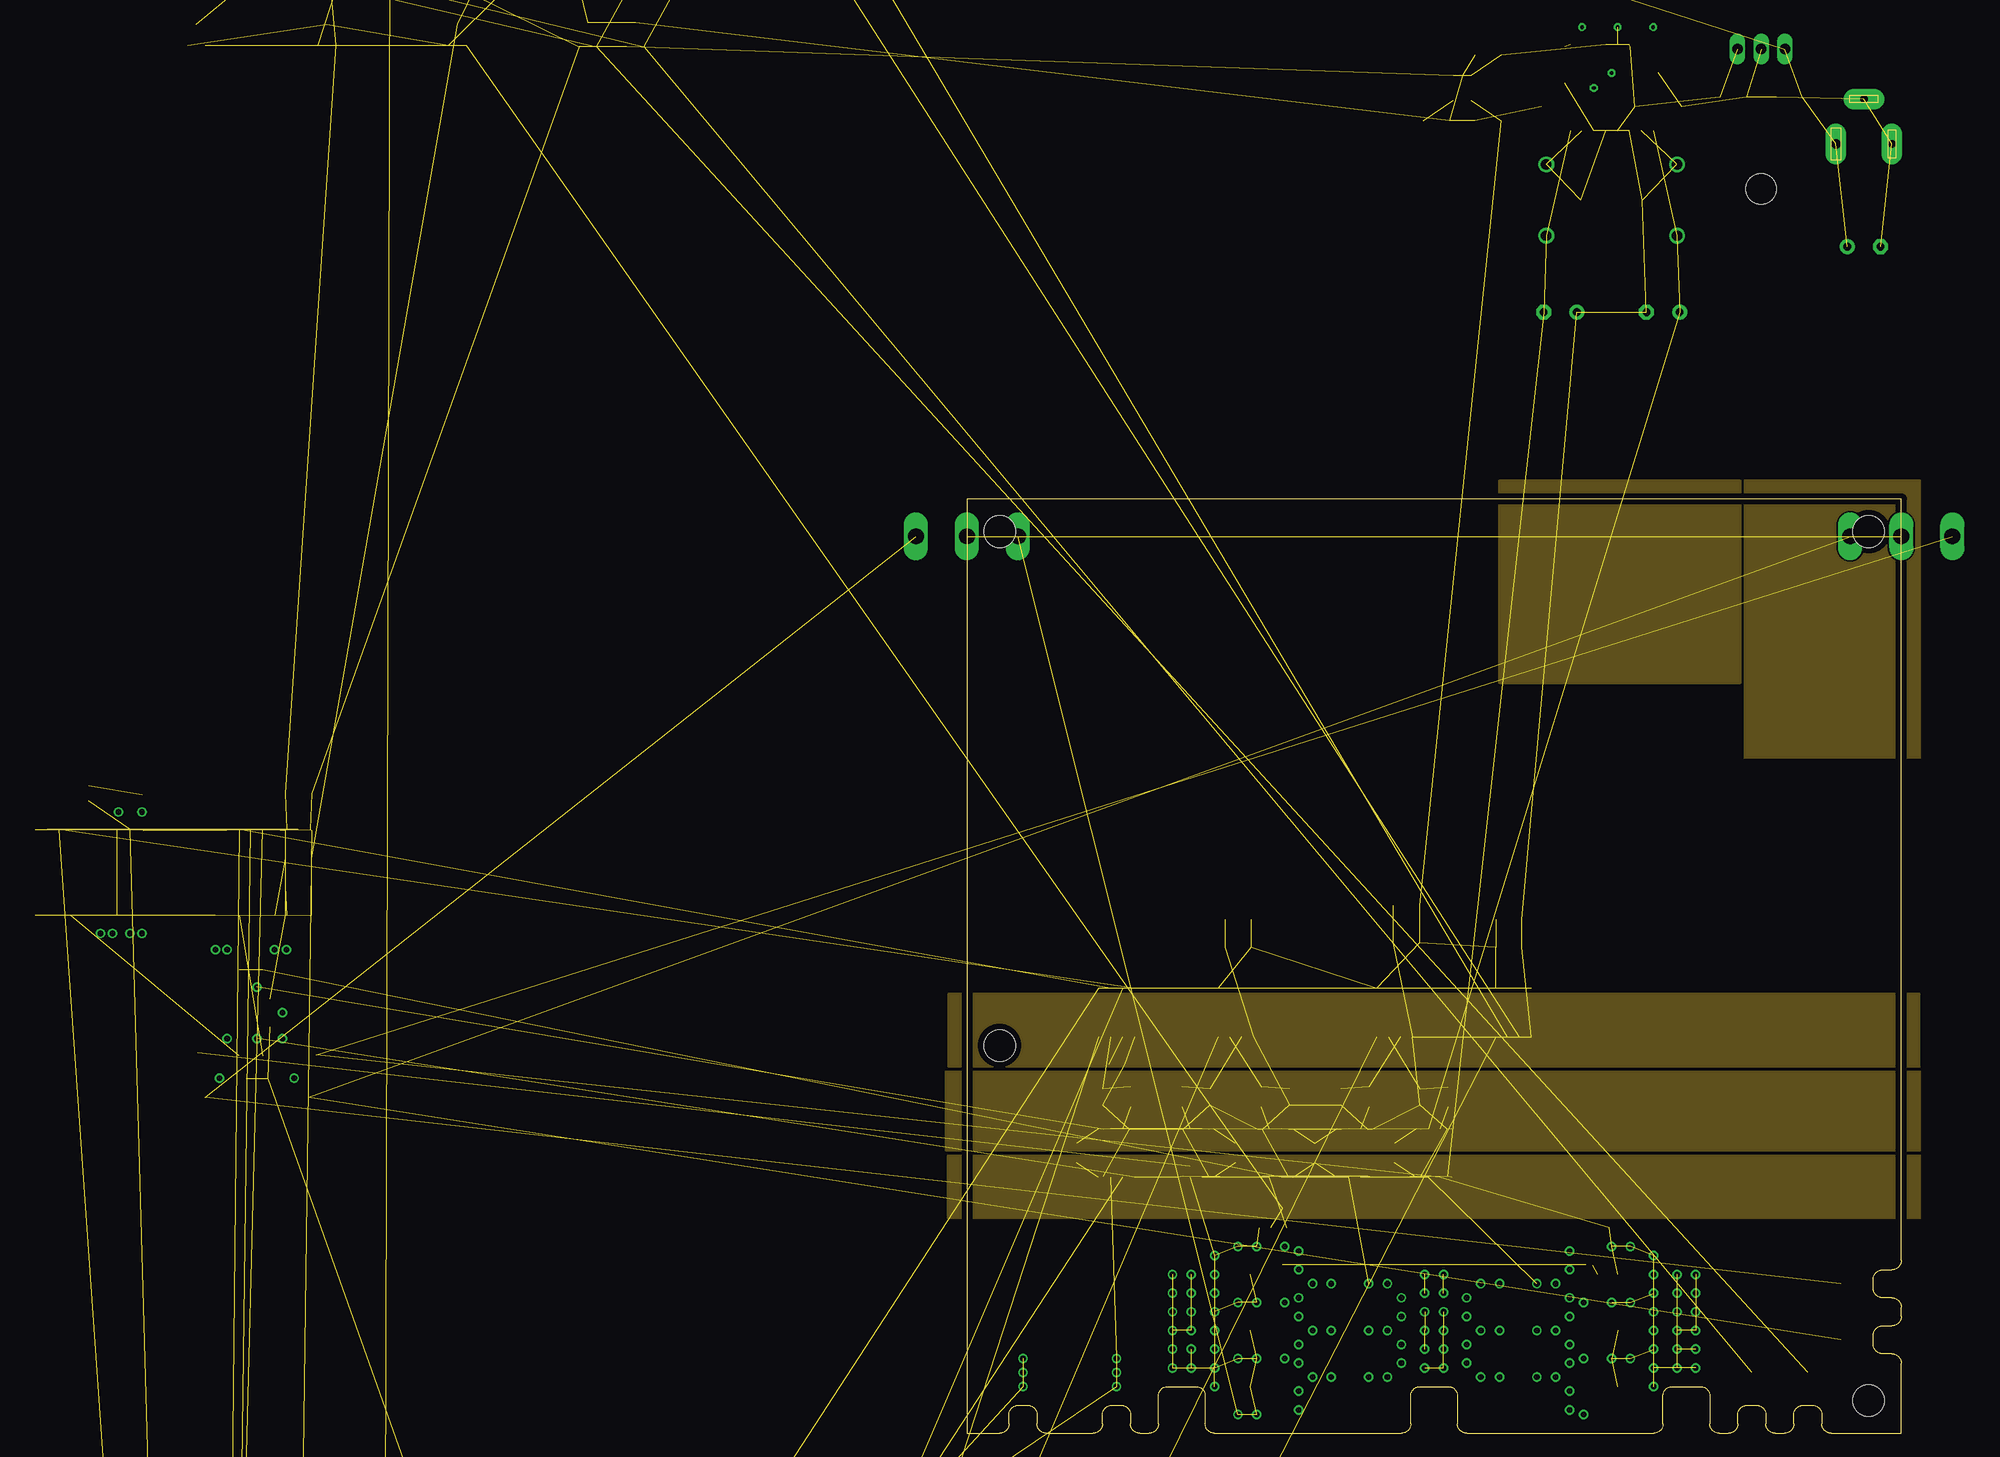
[diagram p7: board, inner layer Route15]
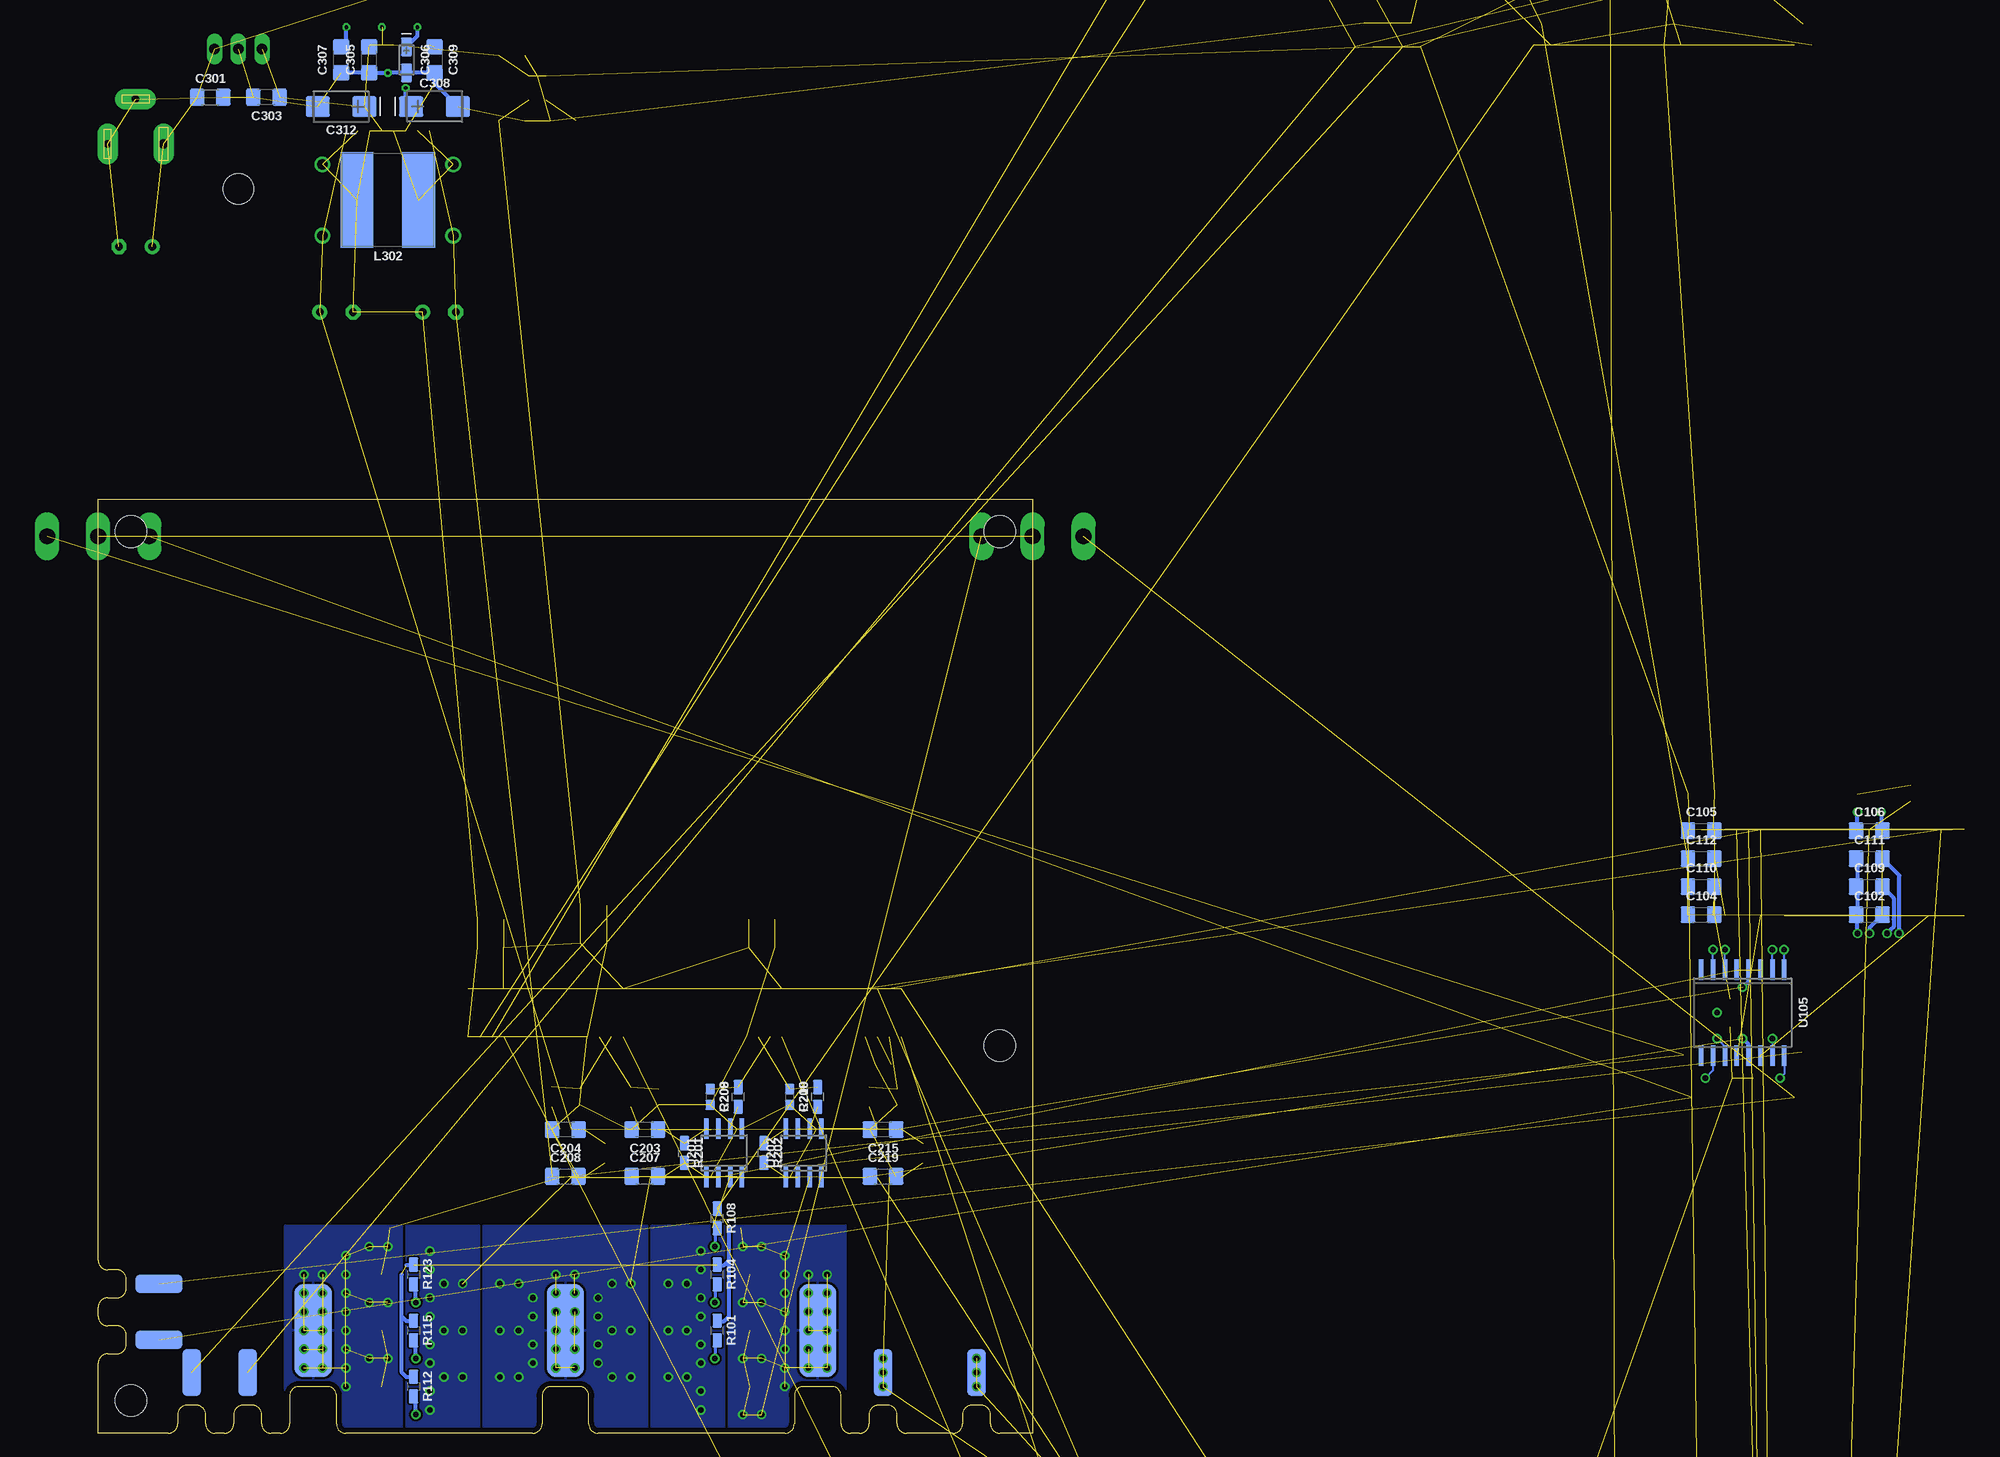
[diagram p8: board, bottom side, seen from below]

Size 100 x 100 mm. Coordinates in mm from the lower left corner, seen from the top.
Outline: 26.5,0 46.5,0 arc90 47.5,1 47.5,4 arc-90 48.5,5 51.5,5 arc-90 52.5,4 52.5,1 arc90 53.5,0 73.5,0 arc90 74.5,1 74.5,4 arc-90 75.5,5 78.5,5 arc-90 79.5,4 79.5,1 arc90 80.5,0 81.5,0 arc90 82.5,1 82.5,2 arc-90 83.5,3 84.5,3 arc-90 85.5,2 85.5,1 arc90 86.5,0 87.5,0 arc90 88.5,1 88.5,2 arc-90 89.5,3 90.5,3 arc-90 91.5,2 91.5,1 arc90 92.5,0 100,0 100,7.5 arc90 99,8.5 98,8.5 arc-90 97,9.5 97,10.5 arc-90 98,11.5 99,11.5 arc90 100,12.5 100,13.5 arc90 99,14.5 98,14.5 arc-90 97,15.5 97,16.5 arc-90 98,17.5 99,17.5 arc90 100,18.5 100,100 0,100 0,0 3.5,0 arc90 4.5,1 4.5,2 arc-90 5.5,3 6.5,3 arc-90 7.5,2 7.5,1 arc90 8.5,0 13.5,0 arc90 14.5,1 14.5,2 arc-90 15.5,3 16.5,3 arc-90 17.5,2 17.5,1 arc90 18.5,0 19.5,0 arc90 20.5,1 20.5,4 arc-90 21.5,5 24.5,5 arc-90 25.5,4 25.5,1 arc90 26.5,0
Copper layers (1+2*15+16): Top 0.035mm / dielectric 0.18mm / Route2 0.017mm / dielectric 1.12mm / Route15 0.017mm / dielectric 0.18mm / Bottom 0.035mm
Design rules "JLCPCB 4 layers 1oz *": minimum track width 6mil, minimum drill 0.35mm, track to track 6mil, track to pad 6mil, pad to pad 6mil, via to via 6mil, smd to smd 6mil, copper to edge 0.6mm, drill to drill 6mil, minimum pad ring 10mil, minimum via ring 8mil, stop-mask expansion 4mil, vias tented up to drill 0mil, thermal gap 10mil

### Footprints (pad centres in the part's own frame; a part is rotated, then mirrored left to right if it is on the bottom)
CT3216 = smd 2 x 1.2: + -1.4,0; - 1.4,0
C3216 = smd 1.6 x 1.8: 1 -1.4,0; 2 1.4,0
C1608 = smd 1.1 x 1: 1 -0.85,0; 2 0.85,0
E3,5-10 = drill 0.813 pad 1.6: + -1.778,0 | drill 0.813 pad 1.6 octagon: - 1.778,0
CT6032 = smd 2.6 x 2.2: + -2.5,0; - 2.5,0
DO41-7.6 = drill 1.1 pad 1.7: A 3.81,0; C -3.81,0
TO220H = drill 1.118 long: 1 -2.54,-10.16; 2 0,-10.16; 3 2.54,-10.16 | hole 3.302: 0,4.826
SPC4077 = drill 0.8 pad 2.184 long: 1 -3,0; 2 0,-4.8 | drill 1 pad 2.184 long: 3 3,0
SRN1060 = smd 3.5 x 10.2: 1 -3.3,0; 2 3.3,0
R3225W = smd 1.8 x 1.8: 1 -1.499,0; 2 1.499,0
PAD-10X4 = smd 10 x 4: 1 0,0
PAD-5X2 = smd 5 x 2: 1 0,0
TO-264P-V = drill 1.7 pad 2.4 long: 1 -5.46,0; 2 0,0; 3 5.46,0
POWERPAK-SO-8 = smd 1.27 x 0.61: 1 -2.67,1.905; 2 -2.67,0.635; 3 -2.67,-0.635; 4 -2.67,-1.905 | smd 3.81 x 3.91: 5 0.69,0
SOT23-BEC = smd 1 x 1.4: B -0.95,-1.1; C 0,1.1; E 0.95,-1.1
R2012W = smd 1.5 x 1: 1 -1.052,0; 2 1.052,0
R1608 = smd 1 x 1.1: 1 -0.85,0; 2 0.85,0
R6332W = smd 2 x 2.1: 1 -2.896,0; 2 2.896,0
R3216W = smd 1.8 x 1.2: 1 -1.499,0; 2 1.499,0
SO24W = smd 0.6 x 2.2: 1 -6.985,-4.6; 2 -5.715,-4.6; 3 -4.445,-4.6; 4 -3.175,-4.6; 5 -1.905,-4.6; 6 -0.635,-4.6; 7 0.635,-4.6; 8 1.905,-4.6; 9 3.175,-4.6; 10 4.445,-4.6; 11 5.715,-4.6; 12 6.985,-4.6; 13 6.985,4.6; 14 5.715,4.6; 15 4.445,4.6; 16 3.175,4.6; 17 1.905,4.6; 18 0.635,4.6; 19 -0.635,4.6; 20 -1.905,4.6; 21 -3.175,4.6; 22 -4.445,4.6; 23 -5.715,4.6; 24 -6.985,4.6
SOT23W = smd 1 x 1.4: 1 -0.95,-1.303; 2 0.95,-1.303; 3 0,1.303
SO16W = smd 0.6 x 2.2: 1 -4.445,-4.6; 2 -3.175,-4.6; 3 -1.905,-4.6; 4 -0.635,-4.6; 5 0.635,-4.6; 6 1.905,-4.6; 7 3.175,-4.6; 8 4.445,-4.6; 9 4.445,4.6; 10 3.175,4.6; 11 1.905,4.6; 12 0.635,4.6; 13 -0.635,4.6; 14 -1.905,4.6; 15 -3.175,4.6; 16 -4.445,4.6
SO8 = smd 0.6 x 2.2: 1 -1.905,-2.6; 2 -0.635,-2.6; 3 0.635,-2.6; 4 1.905,-2.6; 5 1.905,2.6; 6 0.635,2.6; 7 -0.635,2.6; 8 -1.905,2.6
SOT23-5L = smd 0.55 x 1.2: 1 -0.95,-1.3; 2 0,-1.3; 3 0.95,-1.3; 4 0.95,1.3; 5 -0.95,1.3
M3 = hole 3.4: 0,0

### Placement (x,y rotation side)
C101  -89.56,68.5 180 top  (outside the outline)
C102  -89.56,55.5 0 bottom  (outside the outline)
C103  -71.56,68.5 180 top  (outside the outline)
C104  -71.56,55.5 0 bottom  (outside the outline)
C105  -71.56,64.5 0 bottom  (outside the outline)
C106  -89.56,64.5 0 bottom  (outside the outline)
C107  -60.88,177.63 0 top  (outside the outline)
C108  -45.64,166.2 0 top  (outside the outline)
C109  -89.56,58.5 0 bottom  (outside the outline)
C110  -71.56,58.5 0 bottom  (outside the outline)
C111  -89.56,61.5 0 bottom  (outside the outline)
C112  -71.56,61.5 0 bottom  (outside the outline)
C113  -76.12,166.2 0 top  (outside the outline)
C114  -69.77,157.31 0 top  (outside the outline)
C115  -76.12,157.31 0 top  (outside the outline)
C116  -65.96,177.63 0 top  (outside the outline)
C117  -71.04,177.63 0 top  (outside the outline)
C118  -76,46.5 0 top  (outside the outline)
C119  -76,43.5 0 top  (outside the outline)
C120  58,52 0 top
C121  58,55 0 top
C201  24.5,32.5 180 top
C202  33,32.5 180 top
C203  41.5,32.5 180 bottom
C204  50,32.5 180 bottom
C205  24.5,27.5 0 top
C206  33,27.5 0 top
C207  41.5,27.5 0 bottom
C208  50,27.5 0 bottom
C209  34.5,36 270 bottom
C210  26,36 270 bottom
C211  48.5,36 270 top
C212  40,36 270 top
C213  29,52 180 top
C214  47,52.5 180 top
C215  16,32.5 180 bottom
C216  29,55 180 top
C217  47,56.5 180 top
C218  14.5,36 270 top
C219  16,27.5 0 bottom
C220  -46,-47 0 top  (outside the outline)
C221  -47,-60 0 top  (outside the outline)
C301  88,143 0 bottom  (outside the outline)
C302  96,127 0 top  (outside the outline)
C303  82,143 180 bottom  (outside the outline)
C304  55.75,147.5 180 top  (outside the outline)
C305  71,147 90 bottom  (outside the outline)
C306  67,147 270 bottom  (outside the outline)
C307  74,147 90 bottom  (outside the outline)
C308  64,142 0 bottom  (outside the outline)
C309  64,147 270 bottom  (outside the outline)
C310  50.25,140.5 0 top  (outside the outline)
C311  55.75,140.5 180 top  (outside the outline)
C312  74,142 180 bottom  (outside the outline)
C313  74.5,120 180 top  (outside the outline)
C314  63.5,120 180 top  (outside the outline)
C401  -54,-166 0 top  (outside the outline)
C402  -77,-174 0 top  (outside the outline)
C403  -49,-166 0 top  (outside the outline)
C404  -82,-174 0 top  (outside the outline)
C405  -74,-185 0 top  (outside the outline)
C406  -72,-174 0 top  (outside the outline)
C407  -67,-174 0 top  (outside the outline)
C408  -62,-185 0 top  (outside the outline)
C409  -70,-185 0 top  (outside the outline)
C410  -66,-185 0 top  (outside the outline)
C411  -58,-185 0 top  (outside the outline)
C412  -54,-185 0 top  (outside the outline)
C413  -54,-215 0 top  (outside the outline)
C414  -67,-223 0 top  (outside the outline)
C415  -74,-234 0 top  (outside the outline)
C416  -62,-234 0 top  (outside the outline)
C417  -49,-215 0 top  (outside the outline)
C418  -82,-223 0 top  (outside the outline)
C419  -77,-223 0 top  (outside the outline)
C420  -72,-223 0 top  (outside the outline)
C421  -70,-234 0 top  (outside the outline)
C422  -66,-234 0 top  (outside the outline)
C423  -58,-234 0 top  (outside the outline)
C424  -54,-234 0 top  (outside the outline)
D301  76,132 90 top  (outside the outline)
D302  62,132 270 top  (outside the outline)
IC301  85,138 180 top  (outside the outline)
J301  96,138 180 top  (outside the outline)
L301  69,132 0 top  (outside the outline)
L302  69,132 180 bottom  (outside the outline)
MOV201  -82,-48 0 top  (outside the outline)
MOV202  -76,-48 0 top  (outside the outline)
MOV203  -70,-48 0 top  (outside the outline)
MOV204  -64,-48 0 top  (outside the outline)
PAD601  50,11 90 top
PAD602  50,11 270 bottom
PAD603  23,11 90 top
PAD604  23,11 90 bottom
PAD605  77,11 90 top
PAD606  77,11 90 bottom
PAD607  93.5,16 0 top
PAD608  93.5,16 0 bottom
PAD609  93.5,10 0 top
PAD610  93.5,10 0 bottom
PAD611  84,6.5 90 top
PAD612  84,6.5 270 bottom
PAD613  90,6.5 90 top
PAD614  90,6.5 270 bottom
PAD615  6,6.5 90 bottom
PAD616  6,6.5 90 top
PAD617  16,6.5 90 top
PAD618  16,6.5 90 bottom
Q1  0,96 0 top
Q2  100,96 0 top
Q101  31,5 180 top
Q102  31,11 180 top
Q103  -68.5,149.69 0 top  (outside the outline)
Q104  31,17 180 top
Q105  -54.53,149.69 0 top  (outside the outline)
Q106  -82.47,149.69 0 top  (outside the outline)
Q108  69,5 0 top
Q109  69,11 0 top
Q110  69,17 0 top
Q401  -82,-151 0 top  (outside the outline)
Q402  -68,-151 0 top  (outside the outline)
Q403  -82,-159 0 top  (outside the outline)
Q404  -68,-159 0 top  (outside the outline)
Q405  -82,-167 0 top  (outside the outline)
Q406  -68,-167 0 top  (outside the outline)
Q407  -68,-216 0 top  (outside the outline)
Q408  -82,-208 0 top  (outside the outline)
Q409  -82,-200 0 top  (outside the outline)
Q410  -68,-200 0 top  (outside the outline)
Q411  -68,-208 0 top  (outside the outline)
Q412  -82,-216 0 top  (outside the outline)
R101  33.75,11 270 bottom
R102  -94,68.5 270 top  (outside the outline)
R103  -24.05,182.71 0 top  (outside the outline)
R104  33.75,17 270 bottom
R105  -55.8,177.63 0 top  (outside the outline)
R106  -20.24,182.71 0 top  (outside the outline)
R107  -81.5,37 270 top  (outside the outline)
R108  33.75,23 270 bottom
R109  41,8.5 180 top
R110  32.75,22 180 top
R111  41,13.5 180 top
R112  66.25,5 270 bottom
R113  -81.5,40.75 0 top  (outside the outline)
R114  -70.5,40.5 180 top  (outside the outline)
R115  66.25,11 270 bottom
R116  -81.5,48.25 180 top  (outside the outline)
R117  -81.5,45.75 180 top  (outside the outline)
R118  -70.5,48 0 top  (outside the outline)
R119  -70.5,45.5 0 top  (outside the outline)
R120  -20.24,172.55 0 top  (outside the outline)
R121  -25.32,172.55 0 top  (outside the outline)
R122  -70.5,37 270 top  (outside the outline)
R123  66.25,17 270 bottom
R124  -81.5,43.25 0 top  (outside the outline)
R125  -70.5,43 180 top  (outside the outline)
R126  -78,40.75 180 top  (outside the outline)
R127  -74,40.5 0 top  (outside the outline)
R128  59,8.5 0 top
R129  67.25,22 0 top
R130  -78,38 180 top  (outside the outline)
R131  -74,38 0 top  (outside the outline)
R132  59,13.5 0 top
R201  37.25,30 270 bottom
R202  28.75,30 270 bottom
R203  45.75,30 270 top
R204  37.25,30 270 top
R205  -40,-47 0 top  (outside the outline)
R206  -82,-55 0 top  (outside the outline)
R207  -76,-55 0 top  (outside the outline)
R208  31.5,36 90 bottom
R209  23,36 90 bottom
R210  51.5,36 90 top
R211  43,36 90 top
R212  -70,-55 0 top  (outside the outline)
R213  -64,-55 0 top  (outside the outline)
R214  -46,-67 0 top  (outside the outline)
R215  11.75,30 270 top
R216  17.5,36 90 top
R217  16,39.5 180 top
R401  -62,-174 0 top  (outside the outline)
R402  -83,-180 0 top  (outside the outline)
R403  -57,-174 0 top  (outside the outline)
R404  -52,-174 0 top  (outside the outline)
R405  -78,-180 0 top  (outside the outline)
R406  -73,-180 0 top  (outside the outline)
R407  -68,-180 0 top  (outside the outline)
R408  -53,-180 0 top  (outside the outline)
R409  -63,-180 0 top  (outside the outline)
R410  -58,-180 0 top  (outside the outline)
R411  -83,-185 0 top  (outside the outline)
R412  -78,-185 0 top  (outside the outline)
R413  -73,-229 0 top  (outside the outline)
R414  -52,-223 0 top  (outside the outline)
R415  -68,-229 0 top  (outside the outline)
R416  -53,-229 0 top  (outside the outline)
R417  -62,-223 0 top  (outside the outline)
R418  -57,-223 0 top  (outside the outline)
R419  -83,-229 0 top  (outside the outline)
R420  -78,-229 0 top  (outside the outline)
R421  -63,-229 0 top  (outside the outline)
R422  -58,-229 0 top  (outside the outline)
R423  -83,-234 0 top  (outside the outline)
R424  -78,-234 0 top  (outside the outline)
U101  -94,60 180 top  (outside the outline)
U102  -76,60 180 top  (outside the outline)
U103  -35.48,149.69 0 top  (outside the outline)
U104  -40.56,149.69 0 top  (outside the outline)
U105  -76,45 180 bottom  (outside the outline)
U106  58.5,45 0 top
U201  33,30 0 bottom
U202  24.5,30 0 bottom
U203  50,30 0 top
U204  41.5,30 0 top
U205  16,30 0 top
U206  28.75,45 0 top
U207  45.75,45 0 top
U208  16,45 0 top
U301  53,144 180 top  (outside the outline)
U302  69,144 180 top  (outside the outline)
U401  -80,-143 0 top  (outside the outline)
U402  -71,-143 0 top  (outside the outline)
U403  -62,-143 0 top  (outside the outline)
U404  -80,-192 0 top  (outside the outline)
U405  -71,-192 0 top  (outside the outline)
U406  -62,-192 0 top  (outside the outline)
U$1  [M3]  3.5,96.5 0 top
U$2  [M3]  96.5,96.5 0 top
U$3  [M3]  96.5,3.5 0 top
U$4  [M3]  3.5,41.5 0 top

### Tracks (layer width: path | path; a pad name or v marks a point on that pad's centre or on a via)
+3V3  (13 unrouted)
  pour Route15: -2,39.25 102,39.25 102,47 -2,47
+5V  (via drill 0.4, 0.6)  (62 unrouted)
  Top 0.406: U302.12 U302.13 | U101.2 -88.28,66.28 v-88.28,66.5 -88.28,68.37 C101.+
  Bottom 0.406: C106.1 -88.28,64.63 v-88.28,66.5
  other vias: 69.64,150.5
  pour Route15: 82.75,102 82.75,80.25 57,80.25 57,102
+12V  (via drill 0.6)  (12 unrouted)
  Top 0.406: U101.23 -88.28,53.78 v-88.28,53.5
  Bottom 0.406: v-88.28,53.5 -88.28,55.37 | -88.28,55.37 C102.1 | C109.1 -88.28,58.37 | -88.28,55.37 -88.28,57.87 -88.28,58.37 | C111.1 -88.28,61.37 -88.28,58.87 -88.28,58.37
  pour Route15: 83.25,102 102,102 102,72.25 83.25,72.25
+15V  (via drill 0.6)  (13 unrouted)
  Top 0.406: C118.1 -77.25,46.5 v-76,47.75
  Bottom 0.406: U105.4 -76.64,48.38 v-76,47.75
  pour Route15: -2.25,38.75 102,38.75 102,30.25 -2.25,30.25
-15V  (via drill 0.6)  (13 unrouted)
  Top 0.406: C119.1 -77.25,43.5 v-76,42.25
  Bottom 0.406: U105.13 -76.64,41.62 v-76,42.25
  pour Route15: -2,29.75 102,29.75 102,23 -2,23
BYP_G  (5 unrouted)
  Bottom 0.406: R101.1 33.7,12 33,12 32.5,12.5 32.5,18.5 | 32.5,18.5 32.5,22 | R104.1 33.7,18 33,18 32.5,18.5 | R112.1 66.3,6 67,6 67.5,6.5 67.5,12.5 | R115.1 66.3,12 67,12 67.5,12.5 | R123.1 66.3,18 67,18 | 67.5,12.5 67.5,17
BYP_I  (4 unrouted)
CLR_DAC_I  (4 unrouted)
CSENSE1_H  (via drill 0.6)  (2 unrouted)
  other vias: 39,6 37,6 37,11 39,11 39,16 37,16 35.5,14.5 35.5,12.5 35.5,9.5 35.5,7.5 35.5,17.5 35.5,4.5 35.5,19.5 35.5,2.5
  pour Top: 40.25,-2 33.5,-2 33.5,22.25 40.25,22.25
  pour Bottom: 33,-2 40.75,-2 40.75,22.25 33,22.25
CSENSE1_L  (via drill 0.6)  (36 unrouted)
  Bottom 0.254: 23.86,28.61 U202.3
  other vias: 22,7 24,7 24,9 22,9 22,11 24,11 24,13 22,13 22,15 24,15 29,14 31,14 29,8 31,8 26.5,5 26.5,7 26.5,9 26.5,11 26.5,13 26.5,15 26.5,17 26.5,19 29,2 31,2 29,20 31,20 24,17 22,17
  pour Top (rank 2): 20,22.25 32,22.25 32,-2 20,-2
  pour Bottom (rank 2): 32.5,22.25 20,22.25 20,-2 32.5,-2
CSENSE2_H  (via drill 0.6)  (2 unrouted)
  other vias: 61,6 63,6 63,11 61,11 61,16 63,16 64.5,14.5 64.5,12.5 64.5,17.5 64.5,19.5 64.5,9.5 64.5,7.5 64.5,4.5 64.5,2.5
  pour Top: 66.5,-2 59.75,-2 59.75,22.25 66.5,22.25
  pour Bottom: 59.25,-2 67,-2 67,22.25 59.25,22.25
CSENSE2_L  (via drill 0.6)  (34 unrouted)
  other vias: 73.5,5 69,8 71,8 73.5,7 73.5,9 73.5,11 73.5,13 73.5,15 73.5,17 73.5,19 71,14 69,14 69,20 71,20 76,7 78,7 78,9 76,9 76,11 78,11 78,13 76,13 76,15 78,15 76,17 78,17
  pour Top (rank 2): 68,22.25 80,22.25 80,-2 68,-2
  pour Bottom (rank 2): 80,22.25 67.5,22.25 67.5,-2 80,-2
DAC1_VOUT  (1 unrouted)
DAC2_VOUT  (1 unrouted)
DAC_FAULT  (2 unrouted)
FLT_DAC_I  (3 unrouted)
GATE1  (3 unrouted)
GATE2  (3 unrouted)
GND  (via drill 0.4, 0.6)  (126 unrouted)
  Top 0.406: U302.2 72.17,147.18 70.6,145.6 v69,145.6 | U101.4 -90.82,66.42 | -90.82,66.42 v-90.82,66.5 -90.82,68.37 C101.- | U101.5 -92.09,66.16 -91.75,66.5 -90.9,66.5 -90.82,66.42 | C118.2 -74.6,46.35 v-73.25,45 -74.6,43.65 C119.2
  Bottom 0.406: C307.1 C305.1 v69,145.6 C306.- C309.2 64,144.5 C308.- | v-90.82,66.5 -90.82,64.63 C106.2 | C102.2 -89.56,54.1 v-89.56,53.5
  pour Route2 (rank 4): -5,105 105,105 105,-5 -5,-5
LBQ11_G  (via drill 0.6)
  Top 0.305: Q101.4 33.67,7.67 v34,8
  Bottom 0.305: R101.2 34,9.7 v34,8
LBQ12_G  (via drill 0.6)
  Top 0.305: Q102.4 33.67,13.67 v34,14
  Bottom 0.305: R104.2 34,15.7 v34,14
LBQ13_G  (via drill 0.6)
  Top 0.305: Q104.4 33.67,19.67 v34,20
  Bottom 0.305: R108.2 34,21.7 v34,20
LBQ21_G  (via drill 0.6)
  Top 0.406: Q108.4 66.33,2.33 v66,2
  Bottom 0.406: v66,2 66,3.7 R112.2
LBQ22_G  (via drill 0.6)
  Top 0.406: Q109.4 66.33,8.33 v66,8
  Bottom 0.406: v66,8 66,9.7 R115.2
LBQ23_G  (via drill 0.6)
  Top 0.406: Q110.4 66.33,14.33 v66,14
  Bottom 0.406: v66,14 66,15.7 R123.2
LQ1_G  (via drill 0.6)
  Top 0.203: R126.2 R130.2 v-80,38 -81.45,38 R107.1
  Bottom 0.203: U105.16 -80.44,38.45 v-80,38
LQ2_G  (via drill 0.6)
  Top 0.203: R127.2 R131.2 v-72,38 -70.55,38 R122.1
  Bottom 0.203: U105.10 -72.83,38.83 v-72,38
MISO  (2 unrouted)
MISO_I  (4 unrouted)
MOSI_I  (7 unrouted)
N$1  (1 unrouted)
N$2  (1 unrouted)
N$3  (via drill 0.6)
  Top 0.406: U101.21 -90.82,54.13 v-91.46,53.5
  Bottom 0.406: C109.2 -92.16,57.29 -92.16,55 -92.16,54.22 -91.82,53.88 -91.82,53.86 v-91.46,53.5
N$4  (via drill 0.6)
  Top 0.406: U101.20 -92.09,54.15 -92.37,53.88 -92.37,53.86 v-92.73,53.5
  Bottom 0.406: v-92.73,53.5 -92.73,53.92 -92.77,53.97 -92.77,59.68 C111.2
N$5  (3 unrouted)
N$6  (1 unrouted)
N$7  (1 unrouted)
N$8  (3 unrouted)
N$9  (via drill 0.6)
  Top 0.203: R125.2 -72.5,43 v-73.25,42.25 -74.85,40.64 R127.1
  Bottom 0.203: v-73.25,42.25 -74.09,41.4 U105.11
N$10  (1 unrouted)
N$12  (via drill 0.6)
  Top 0.203: R124.2 -79.65,42.25 v-79.18,42.25 -78.65,42.25 R126.1
  Bottom 0.203: v-79.18,42.25 -79.18,42.17 U105.15
N$13  (via drill 0.6)
  Top 0.203: R124.1 R117.2 R116.2 -80.44,50.16 v-80.44,51.75
  Bottom 0.203: U105.1 -80.44,51.7 v-80.44,51.75
N$14  (via drill 0.6)
  Top 0.203: R113.2 -81.5,41.6 -81.5,44.9 R117.1 R116.1 -79.18,49.73 v-79.18,51.75
  Bottom 0.203: U105.2 -79.18,51.63 v-79.18,51.75
N$15  (via drill 0.6)
  Top 0.203: v-74.09,51.75 -74.09,50.74 R118.1 R119.1 -70.5,44.65 -70.5,41.35 R114.2
  Bottom 0.203: U105.6 -74.09,51.66 v-74.09,51.75
N$16  (via drill 0.6)
  Top 0.203: v-72.83,51.75 -72.83,51.17 R118.2 R119.2 R125.1
  Bottom 0.203: U105.7 -72.83,51.67 v-72.83,51.75
N$17  (1 unrouted)
N$18  (2 unrouted)
N$19  (1 unrouted)
N$20  (2 unrouted)
N$21  (2 unrouted)
N$22  (2 unrouted)
N$23  (1 unrouted)
N$24  (1 unrouted)
N$25  (1 unrouted)
N$26  (1 unrouted)
N$27  (1 unrouted)
N$28  (1 unrouted)
N$29  (2 unrouted)
N$30  (2 unrouted)
N$31  (1 unrouted)
N$32  (1 unrouted)
N$33  (via drill 0.4)
  Top 0.406: U302.7 65.83,150.32 v65.83,150.5
  Bottom 0.406: C306.+ 65.83,149.57 v65.83,150.5
N$34  (via drill 0.4)
  Top 0.406: U302.1 73.44,150.31 v73.44,150.5
  Bottom 0.406: C307.2 73.44,148.95 v73.44,150.5
N$35  (2 unrouted)
N$36  (1 unrouted)
N$41  (2 unrouted)
N$45  (1 unrouted)
N$47  (2 unrouted)
N$49  (2 unrouted)
N$62  (2 unrouted)
N$63  (2 unrouted)
N$64  (2 unrouted)
N$65  (2 unrouted)
N$66  (2 unrouted)
N$67  (2 unrouted)
N$68  (2 unrouted)
N$69  (2 unrouted)
N$73  (2 unrouted)
N$76  (2 unrouted)
N$77  (2 unrouted)
RG1_H4  (1 unrouted)
RG1_H5  (1 unrouted)
RG1_H6  (1 unrouted)
RG1_L3  (1 unrouted)
RG1_L4  (1 unrouted)
RG2_H4  (1 unrouted)
RG2_H5  (1 unrouted)
RG2_H6  (1 unrouted)
RG2_L3  (1 unrouted)
RG2_L4  (1 unrouted)
SCK_I  (8 unrouted)
SDO_DAC1  (1 unrouted)
SS_CH_I  (3 unrouted)
SS_CL_I  (3 unrouted)
SS_DAC_I  (4 unrouted)
SS_TEMP_I  (3 unrouted)
SS_V_I  (3 unrouted)
T1_OUT  (4 unrouted)
T2_OUT  (4 unrouted)
TEMP1  (2 unrouted)
TEMP2  (2 unrouted)
UUT+  (1 unrouted)
UUT-  (via drill 0.6)  (12 unrouted)
  other vias: 49,7 51,7 51,9 49,9 49,11 51,11 51,13 49,13 49,15 51,15 43,6 45,6 43,11 45,11 43,16 45,16 55,11 57,11 57,6 55,6 55,16 57,16 46.5,9.5 46.5,7.5 46.5,12.5 46.5,14.5 53.5,14.5 53.5,12.5 53.5,9.5 53.5,7.5 49,17 51,17
  pour Top: 41.75,-2 41.75,22.25 58.25,22.25 58.25,-2
  pour Bottom: 58.75,-2 58.75,22.25 41.25,22.25 41.25,-2
VREF  (2 unrouted)
VREF2  (via drill 0.4)
  Top 0.406: U302.6 67.09,144.09 v67.09,143.99
  Bottom 0.406: C308.+ 67.09,142.59 v67.09,143.99
VSENSE+  (via drill 0.6)  (4 unrouted)
  other vias: 6,5 6,8 6,6.5
VSENSE-  (via drill 0.6)  (4 unrouted)
  other vias: 16,5 16,6.5 16,8

### Text on the board
tPlace: S1 | -A | S2